# EAGLE design plen_baseboard (EAGLE 6.6.0)

## Sheet 1 of 4: Arduino Micro
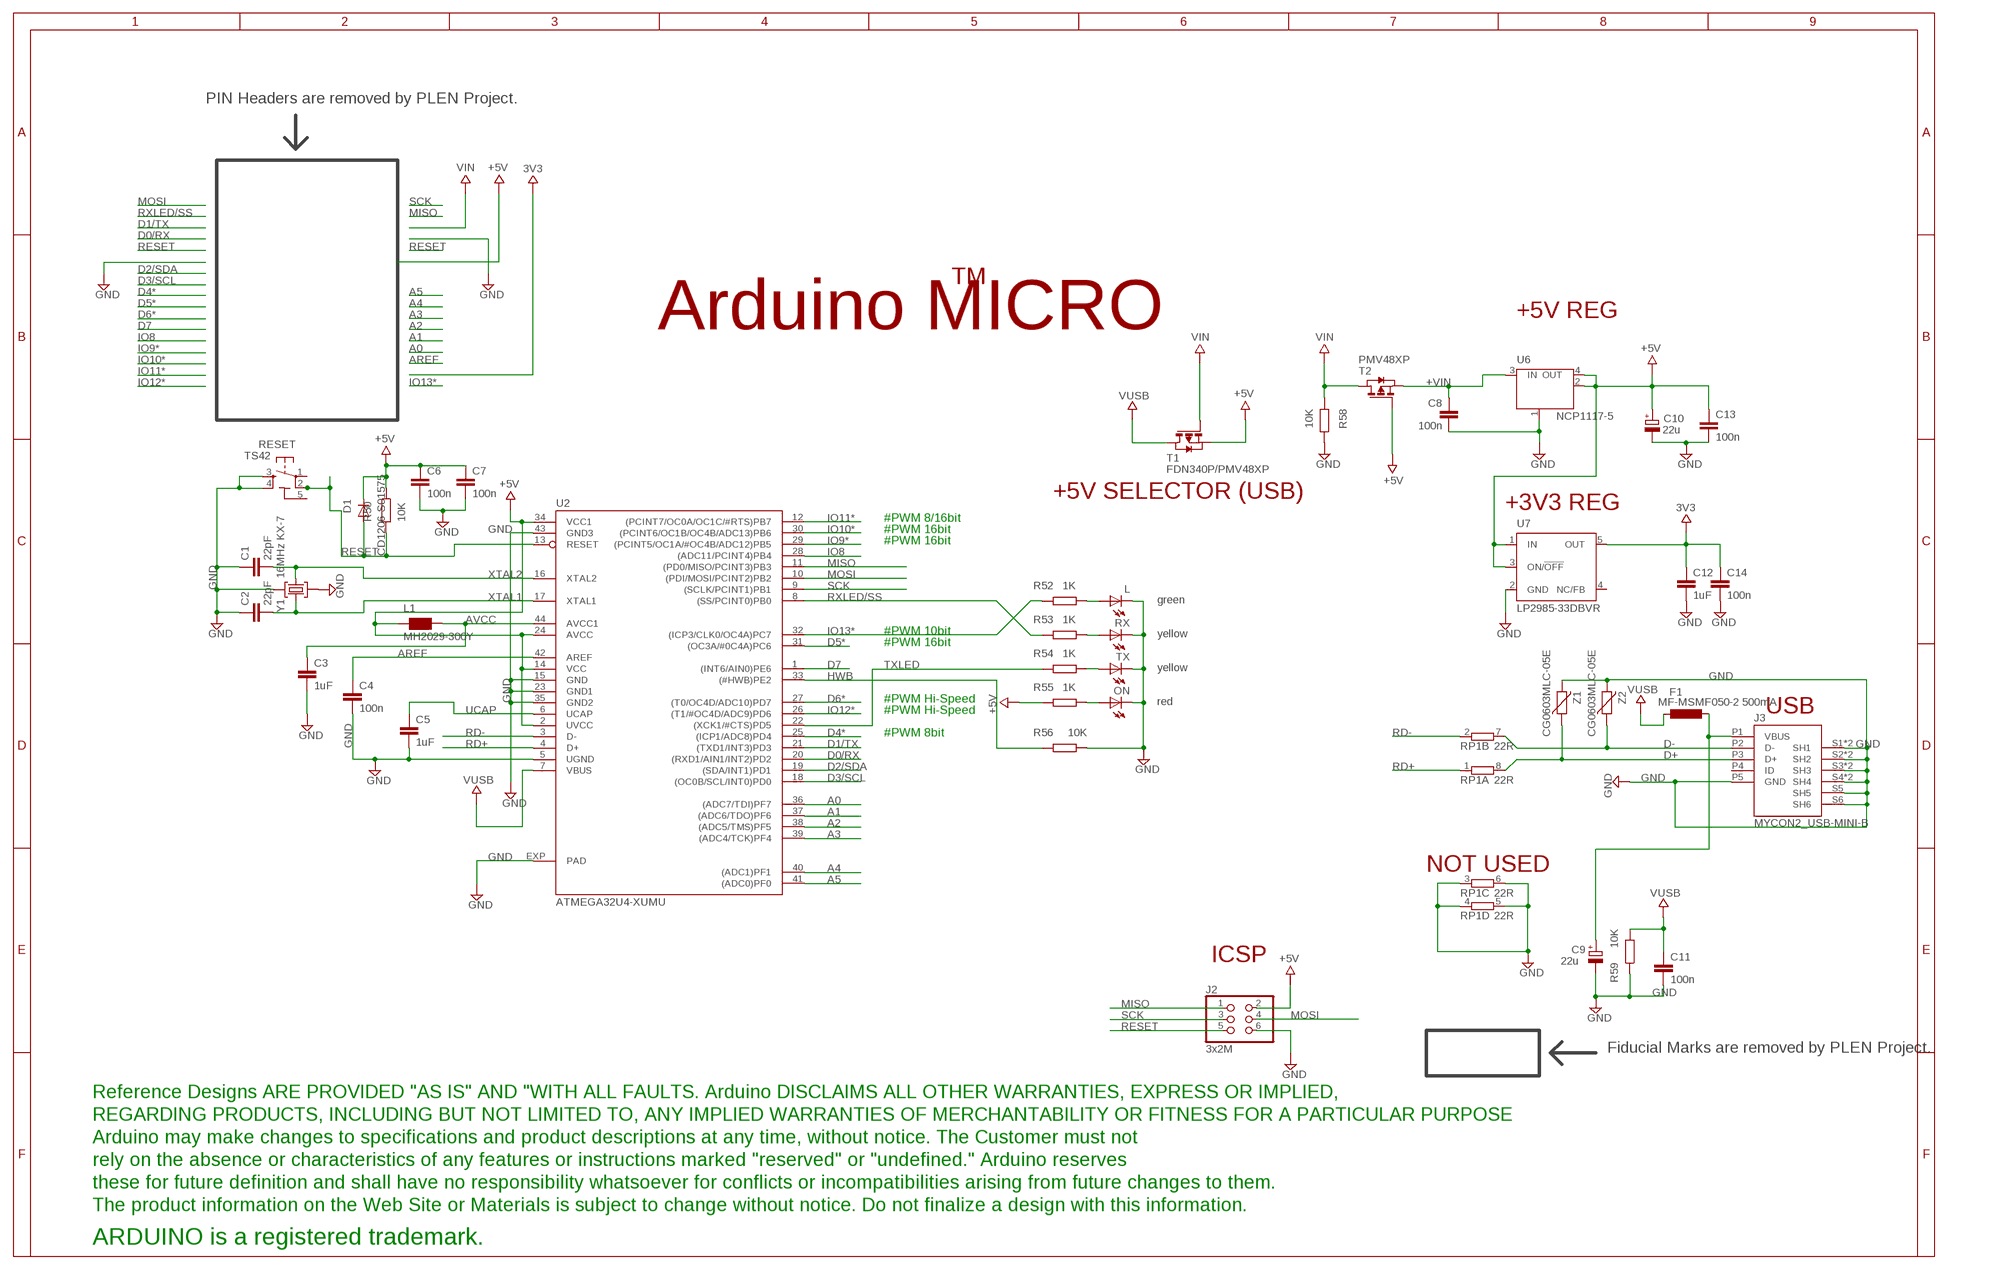
[diagram p0: schematic, sheet 1]

### Parts
C1  22pF  C-EUC0402  [C0402]
C2  22pF  C-EUC0402  [C0402]
C3  1uF  C-EUC0402  [C0402]
C4  100n  C-EUC0402  [C0402]
C5  1uF  C-EUC0402  [C0402]
C6  100n  C-EUC0402  [C0402]
C7  100n  C-EUC0402  [C0402]
C8  100n  C-EUC0402  [C0402]
C9  22u  CPOL-EUSMCB  [SMC_B]
C10  22u  CPOL-EUSMCB  [SMC_B]
C11  100n  C-EUC0402  [C0402]
C12  1uF  C-EUC0402  [C0402]
C13  100n  C-EUC0402  [C0402]
C14  100n  C-EUC0402  [C0402]
D1  CD1206-S01575  DIODE-MINIMELF  [MINIMELF]
F1  MF-MSMF050-2 500mA  L-EUL1812  [L1812]
J2  3x2M  PINHD-2X3  [2X03]
J3  MYCON2_USB-MINI-B  [CON2_USB_MICRO_B_AT]
L  green  LEDCHIPLED_0805  [CHIPLED_0805]
L1  MH2029-300Y  WE-CBF_0805  [0805]
ON  red  LEDCHIPLED_0805  [CHIPLED_0805]
R50  10K  R-EU_R0402  [R0402]
R52  1K  R-EU_R0402  [R0402]
R53  1K  R-EU_R0402  [R0402]
R54  1K  R-EU_R0402  [R0402]
R55  1K  R-EU_R0402  [R0402]
R56  10K  R-EU_R0402  [R0402]
R58  10K  R-EU_R0402  [R0402]
R59  10K  R-EU_R0402  [R0402]
RESET  TS42  [TS42]
RP1  22R  4R-NCAY16  [CAY16]
RX  yellow  LEDCHIPLED_0805  [CHIPLED_0805]
T1  FDN340P/PMV48XP  PMOSSOT23  [SOT-23]
T2  PMV48XP  PMOSSOT23  [SOT-23]
TX  yellow  LEDCHIPLED_0805  [CHIPLED_0805]
U2  ATMEGA32U4-XUMU  [QFN44ML7X7]
U6  NCP1117-5  LINEAR_MC33269ST  [LINEAR_SOT223]
U7  LP2985-33DBVR  LP2985-XXDBVR33  [SOT23-DBV]
U$3  DISCLAIMER  [DISCLAIMER]
Y1  16MHz KX-7  CRYSTAL-3.2-2.5  [CRYSTAL-3.2-2.5]
Z1  CG0603MLC-05E  VARISTORCN0603  [CT/CN0603]
Z2  CG0603MLC-05E  VARISTORCN0603  [CT/CN0603]

### Nets
3V3: C12.1 C14.1 U7.5(OUT) ; also sheet 3
+5V: C6.1 C7.1 C10.+ C13.1 D1.C J2.2 L1.1 R50.1 R55.1 T1.2(S) T2.3(G) U2.2(UVCC) U2.14(VCC) U2.24(AVCC) U2.34(VCC1) U6.2(OUT) U6.4(OUT) U7.1(IN) U7.3(ON/!OFF) ; also sheet 2,4
+VIN: C8.1 T2.2(S) U6.3(IN)
A0: U2.36((ADC7/TDI)PF7)
A1: U2.37((ADC6/TDO)PF6)
A2: U2.38((ADC5/TMS)PF5)
A3: U2.39((ADC4/TCK)PF4)
A4: U2.40((ADC1)PF1)
A5: U2.41((ADC0)PF0)
AREF: C4.1 U2.42(AREF)
AVCC: C3.1 L1.2 U2.44(AVCC1)
D0/RX: U2.20((RXD1/AIN1/INT2)PD2) ; also sheet 3
D1/TX: U2.21((TXD1/INT3)PD3) ; also sheet 3
D2/SDA: U2.19((SDA/INT1)PD1) ; also sheet 4
D3/SCL: U2.18((OC0B/SCL/INT0)PD0) ; also sheet 4
D4*: U2.25((ICP1/ADC8)PD4) ; also sheet 3
D5*: U2.31((OC3A/#0C4A)PC6) ; also sheet 2
D6*: U2.27((T0/OC4D/ADC10)PD7) ; also sheet 2
D7: U2.1((INT6/AIN0)PE6)
D+: J3.P3(D+) RP1.8 Z1.1
D-: J3.P2(D-) RP1.7 Z2.1
GND: C1.1 C2.1 C3.2 C4.2 C5.2 C6.2 C7.2 C8.2 C9.- C10.- C11.2 C12.2 C13.2 C14.2 J2.6 J3.P5(GND) J3.S1(SH1) J3.S2(SH2) J3.S3(SH3) J3.S4(SH4) J3.S5(SH5) J3.S6(SH6) J3.S7(SH1) J3.S8(SH2) J3.S9(SH3) J3.S10(SH4) L.C ON.C R56.2 R58.1 R59.1 RESET.3 RESET.4 RP1.3 RP1.4 RP1.5 RP1.6 RX.C TX.C U2.5(UGND) U2.15(GND) U2.23(GND1) U2.35(GND2) U2.43(GND3) U2.EXP(PAD) U6.1(GND/ADJ) U7.2(GND) Y1.2(GND) Y1.4(GND) Z1.2 Z2.2 ; also sheet 2,3,4
HWB: R56.1 U2.33((#HWB)PE2)
IO8: U2.28((ADC11/PCINT4)PB4)
IO9*: U2.29((PCINT5/OC1A/#OC4B/ADC12)PB5) ; also sheet 2
IO10*: U2.30((PCINT6/OC1B/OC4B/ADC13)PB6) ; also sheet 2
IO11*: U2.12((PCINT7/OC0A/OC1C/#RTS)PB7) ; also sheet 2
IO12*: U2.26((T1/#OC4D/ADC9)PD6) ; also sheet 2
IO13*: R52.1 U2.32((ICP3/CLK0/OC4A)PC7)
MISO: J2.1 U2.11((PD0/MISO/PCINT3)PB3)
MOSI: J2.4 U2.10((PDI/MOSI/PCINT2)PB2)
N$2: R53.2 RX.A
N$3: ON.A R55.2
N$4: R54.2 TX.A
N$7: L.A R52.2
RD+: RP1.1 U2.4(D+)
RD-: RP1.2 U2.3(D-)
RESET: D1.A J2.5 R50.2 RESET.2 U2.13(RESET) ; also sheet 3
RXLED/SS: R53.1 U2.8((SS/PCINT0)PB0)
SCK: J2.3 U2.9((SCLK/PCINT1)PB1)
TXLED: R54.1 U2.22((XCK1/#CTS)PD5)
UCAP: C5.1 U2.6(UCAP)
VIN: R58.2 T1.3(G) T2.1(D) ; also sheet 2
VUSB: C11.1 F1.2 R59.2 T1.1(D) U2.7(VBUS)
VUSBD: C9.+ F1.1 J3.P1(VBUS)
XTAL1: C2.2 U2.17(XTAL1) Y1.3(C2)
XTAL2: C1.2 U2.16(XTAL2) Y1.1(C1)
Unconnected: J3.P4(ID) RESET.1 U7.4(NC/FB)

### Notes on the sheet
- PIN Headers are removed by PLEN Project.
- TM
- +5V REG
- Arduino MICRO
- +5V SELECTOR (USB)
- +3V3 REG
- #PWM 8/16bit
- #PWM 16bit
- #PWM 16bit
- #PWM 10bit
- #PWM 16bit
- #PWM Hi-Speed
- #PWM Hi-Speed | USB
- #PWM 8bit
- NOT USED
- ICSP
- Fiducial Marks are removed by PLEN Project.

## Sheet 2 of 4: Multi-ServoMotor Interface
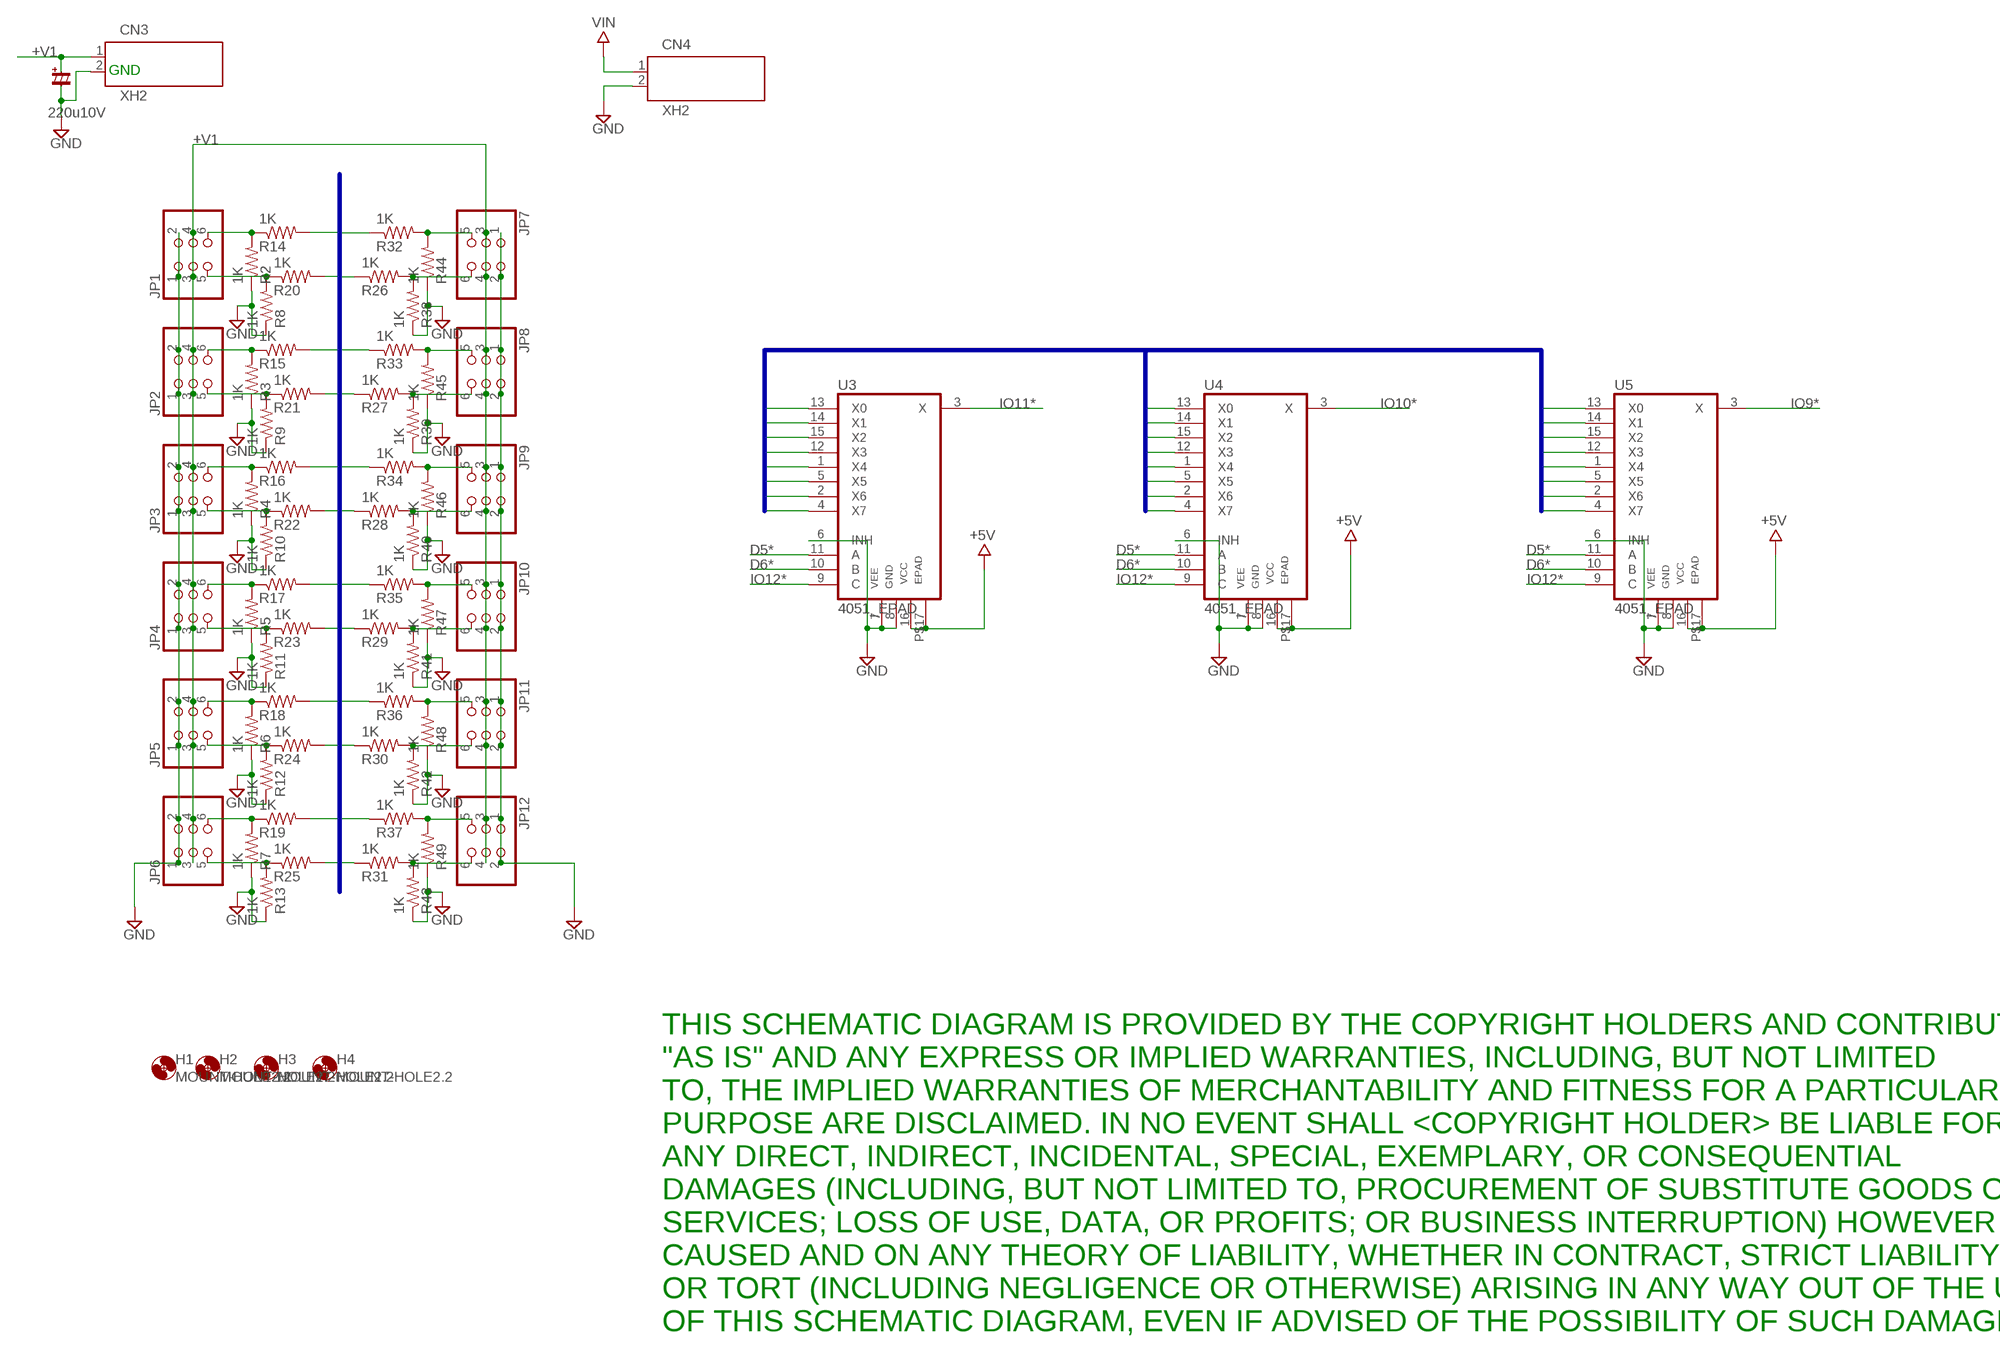
[diagram p1: schematic, sheet 2]

### Parts
CN3  XH2  [XH2]
CN4  XH2  [XH2]
CP1  220u10V  C-POL_S05-05  [CP_S05-05]
H1  MOUNT-HOLE2.2  [2,2]
H2  MOUNT-HOLE2.2  [2,2]
H3  MOUNT-HOLE2.2  [2,2]
H4  MOUNT-HOLE2.2  [2,2]
JP1  PINHD-2X03_2.54  [2X03]
JP2  PINHD-2X03_2.54  [2X03]
JP3  PINHD-2X03_2.54  [2X03]
JP4  PINHD-2X03_2.54  [2X03]
JP5  PINHD-2X03_2.54  [2X03]
JP6  PINHD-2X03_2.54  [2X03]
JP7  PINHD-2X03_2.54  [2X03]
JP8  PINHD-2X03_2.54  [2X03]
JP9  PINHD-2X03_2.54  [2X03]
JP10  PINHD-2X03_2.54  [2X03]
JP11  PINHD-2X03_2.54  [2X03]
JP12  PINHD-2X03_2.54  [2X03]
R2  1K  R-US_R0402SMALL  [R0402S]
R3  1K  R-US_R0402SMALL  [R0402S]
R4  1K  R-US_R0402SMALL  [R0402S]
R5  1K  R-US_R0402SMALL  [R0402S]
R6  1K  R-US_R0402SMALL  [R0402S]
R7  1K  R-US_R0402SMALL  [R0402S]
R8  1K  R-US_R0402SMALL  [R0402S]
R9  1K  R-US_R0402SMALL  [R0402S]
R10  1K  R-US_R0402SMALL  [R0402S]
R11  1K  R-US_R0402SMALL  [R0402S]
R12  1K  R-US_R0402SMALL  [R0402S]
R13  1K  R-US_R0402SMALL  [R0402S]
R14  1K  R-US_R0402SMALL  [R0402S]
R15  1K  R-US_R0402SMALL  [R0402S]
R16  1K  R-US_R0402SMALL  [R0402S]
R17  1K  R-US_R0402SMALL  [R0402S]
R18  1K  R-US_R0402SMALL  [R0402S]
R19  1K  R-US_R0402SMALL  [R0402S]
R20  1K  R-US_R0402SMALL  [R0402S]
R21  1K  R-US_R0402SMALL  [R0402S]
R22  1K  R-US_R0402SMALL  [R0402S]
R23  1K  R-US_R0402SMALL  [R0402S]
R24  1K  R-US_R0402SMALL  [R0402S]
R25  1K  R-US_R0402SMALL  [R0402S]
R26  1K  R-US_R0402SMALL  [R0402S]
R27  1K  R-US_R0402SMALL  [R0402S]
R28  1K  R-US_R0402SMALL  [R0402S]
R29  1K  R-US_R0402SMALL  [R0402S]
R30  1K  R-US_R0402SMALL  [R0402S]
R31  1K  R-US_R0402SMALL  [R0402S]
R32  1K  R-US_R0402SMALL  [R0402S]
R33  1K  R-US_R0402SMALL  [R0402S]
R34  1K  R-US_R0402SMALL  [R0402S]
R35  1K  R-US_R0402SMALL  [R0402S]
R36  1K  R-US_R0402SMALL  [R0402S]
R37  1K  R-US_R0402SMALL  [R0402S]
R38  1K  R-US_R0402SMALL  [R0402S]
R39  1K  R-US_R0402SMALL  [R0402S]
R40  1K  R-US_R0402SMALL  [R0402S]
R41  1K  R-US_R0402SMALL  [R0402S]
R42  1K  R-US_R0402SMALL  [R0402S]
R43  1K  R-US_R0402SMALL  [R0402S]
R44  1K  R-US_R0402SMALL  [R0402S]
R45  1K  R-US_R0402SMALL  [R0402S]
R46  1K  R-US_R0402SMALL  [R0402S]
R47  1K  R-US_R0402SMALL  [R0402S]
R48  1K  R-US_R0402SMALL  [R0402S]
R49  1K  R-US_R0402SMALL  [R0402S]
U3  4051_EPAD  [SOT763-1]
U4  4051_EPAD  [SOT763-1]
U5  4051_EPAD  [SOT763-1]

### Nets
+5V: U3.16(VCC) U3.P$17(EPAD) U4.16(VCC) U4.P$17(EPAD) U5.16(VCC) U5.P$17(EPAD) ; also sheet 1,4
+V1: CN3.1 CP1.+ JP1.3 JP1.4 JP2.3 JP2.4 JP3.3 JP3.4 JP4.3 JP4.4 JP5.3 JP5.4 JP6.3 JP6.4 JP7.3 JP7.4 JP8.3 JP8.4 JP9.3 JP9.4 JP10.3 JP10.4 JP11.3 JP11.4 JP12.3 JP12.4
D5*: U3.11(A) U4.11(A) U5.11(A) ; also sheet 1
D6*: U3.10(B) U4.10(B) U5.10(B) ; also sheet 1
GND: CN3.2 CN4.2 CP1.- JP1.1 JP1.2 JP2.1 JP2.2 JP3.1 JP3.2 JP4.1 JP4.2 JP5.1 JP5.2 JP6.1 JP6.2 JP7.1 JP7.2 JP8.1 JP8.2 JP9.1 JP9.2 JP10.1 JP10.2 JP11.1 JP11.2 JP12.1 JP12.2 R2.1 R3.1 R4.1 R5.1 R6.1 R7.1 R8.1 R9.1 R10.1 R11.1 R12.1 R13.1 R38.1 R39.1 R40.1 R41.1 R42.1 R43.1 R44.1 R45.1 R46.1 R47.1 R48.1 R49.1 U3.6(INH) U3.7(VEE) U3.8(GND) U4.6(INH) U4.7(VEE) U4.8(GND) U5.6(INH) U5.7(VEE) U5.8(GND) ; also sheet 1,3,4
IO9*: U5.3(X) ; also sheet 1
IO10*: U4.3(X) ; also sheet 1
IO11*: U3.3(X) ; also sheet 1
IO12*: U3.9(C) U4.9(C) U5.9(C) ; also sheet 1
N$1: JP1.5 R8.2 R20.1
N$5: JP1.6 R2.2 R14.1
N$6: JP3.5 R10.2 R22.1
N$8: JP2.5 R9.2 R21.1
N$9: JP2.6 R3.2 R15.1
N$10: JP3.6 R4.2 R16.1
N$11: JP4.5 R11.2 R23.1
N$12: JP4.6 R5.2 R17.1
N$13: JP5.5 R12.2 R24.1
N$14: JP5.6 R6.2 R18.1
N$15: JP6.5 R13.2 R25.1
N$16: JP6.6 R7.2 R19.1
N$17: JP7.5 R32.2 R44.2
N$18: JP7.6 R26.2 R38.2
N$19: JP9.5 R34.2 R46.2
N$20: JP8.5 R33.2 R45.2
N$21: JP8.6 R27.2 R39.2
N$22: JP9.6 R28.2 R40.2
N$23: JP10.5 R35.2 R47.2
N$24: JP10.6 R29.2 R41.2
N$25: JP11.5 R36.2 R48.2
N$26: JP11.6 R30.2 R42.2
N$27: JP12.5 R37.2 R49.2
N$28: JP12.6 R31.2 R43.2
SRV0: R14.2 U3.13(X0)
SRV1: R20.2 U3.14(X1)
SRV2: R15.2 U3.15(X2)
SRV3: R21.2 U3.12(X3)
SRV4: R16.2 U3.1(X4)
SRV5: R22.2 U3.5(X5)
SRV6: R17.2 U3.2(X6)
SRV7: R23.2 U3.4(X7)
SRV8: R18.2 U4.13(X0)
SRV9: R24.2 U4.14(X1)
SRV10: R19.2 U4.15(X2)
SRV11: R25.2 U4.12(X3)
SRV12: R32.1 U4.1(X4)
SRV13: R26.1 U4.5(X5)
SRV14: R33.1 U4.2(X6)
SRV15: R27.1 U4.4(X7)
SRV16: R34.1 U5.13(X0)
SRV17: R28.1 U5.14(X1)
SRV18: R35.1 U5.15(X2)
SRV19: R29.1 U5.12(X3)
SRV20: R36.1 U5.1(X4)
SRV21: R30.1 U5.5(X5)
SRV22: R37.1 U5.2(X6)
SRV23: R31.1 U5.4(X7)
VIN: CN4.1 ; also sheet 1

### Buses
SRV[0..23]

### Notes on the sheet
- GND
- THIS SCHEMATIC DIAGRAM IS PROVIDED BY THE COPYRIGHT HOLDERS AND CONTRIBUTORS 
  "AS IS" AND ANY EXPRESS OR IMPLIED WARRANTIES, INCLUDING, BUT NOT LIMITED 
  TO, THE IMPLIED WARRANTIES OF MERCHANTABILITY AND FITNESS FOR A PARTICULAR 
  PURPOSE ARE DISCLAIMED. IN NO EVENT SHALL <COPYRIGHT HOLDER> BE LIABLE FOR 
  ANY DIRECT, INDIRECT, INCIDENTAL, SPECIAL, EXEMPLARY, OR CONSEQUENTIAL 
  DAMAGES (INCLUDING, BUT NOT LIMITED TO, PROCUREMENT OF SUBSTITUTE GOODS OR 
  SERVICES; LOSS OF USE, DATA, OR PROFITS; OR BUSINESS INTERRUPTION) HOWEVER 
  CAUSED AND ON ANY THEORY OF LIABILITY, WHETHER IN CONTRACT, STRICT LIABILITY,
  OR TORT (INCLUDING NEGLIGENCE OR OTHERWISE) ARISING IN ANY WAY OUT OF THE USE
  OF THIS SCHEMATIC DIAGRAM, EVEN IF ADVISED OF THE POSSIBILITY OF SUCH DAMAGE.

## Sheet 3 of 4: RS485 communication port
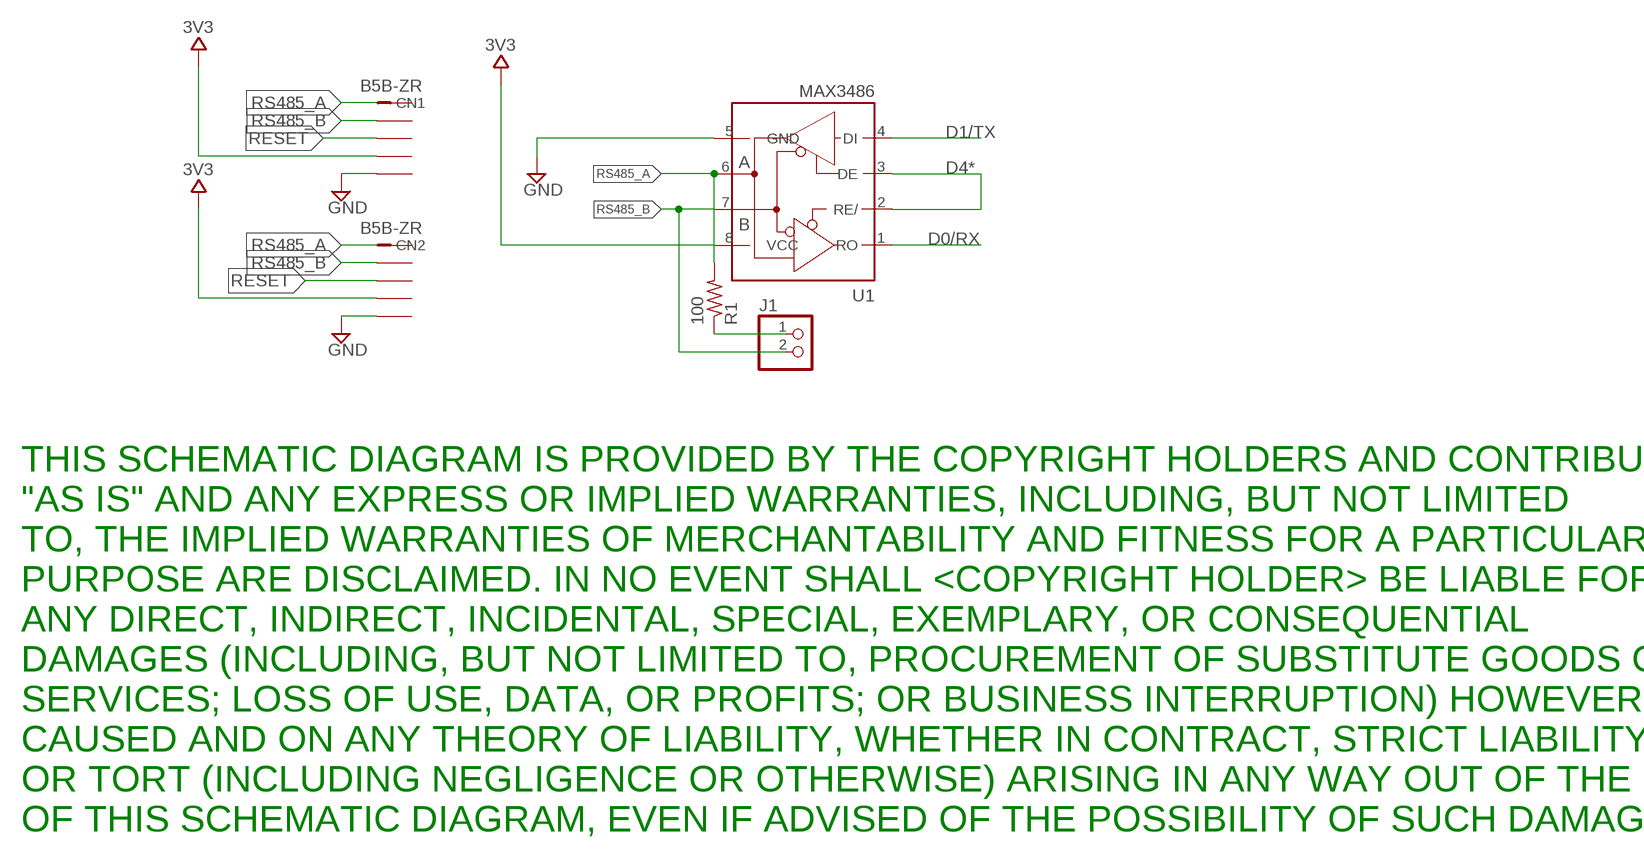
[diagram p2: schematic, sheet 3]

### Parts
CN1  B5B-ZR  [B5B-ZR]
CN2  B5B-ZR  [B5B-ZR]
J1  PINHD-1X2  [1X02]
R1  100  R-US_R0402SMALL  [R0402S]
U1  MAX3486  [SO08]

### Nets
3V3: CN1.4 CN2.4 U1.8(VCC) ; also sheet 1
D0/RX: U1.1(RO) ; also sheet 1
D1/TX: U1.4(DI) ; also sheet 1
D4*: U1.2(RE/) U1.3(DE) ; also sheet 1
GND: CN1.5 CN2.5 U1.5(GND) ; also sheet 1,2,4
N$67: J1.1 R1.1
RESET: CN1.3 CN2.3 ; also sheet 1
RS485_A: CN1.1 CN2.1 R1.2 U1.6(A)
RS485_B: CN1.2 CN2.2 J1.2 U1.7(B)

### Notes on the sheet
- THIS SCHEMATIC DIAGRAM IS PROVIDED BY THE COPYRIGHT HOLDERS AND CONTRIBUTORS 
  "AS IS" AND ANY EXPRESS OR IMPLIED WARRANTIES, INCLUDING, BUT NOT LIMITED 
  TO, THE IMPLIED WARRANTIES OF MERCHANTABILITY AND FITNESS FOR A PARTICULAR 
  PURPOSE ARE DISCLAIMED. IN NO EVENT SHALL <COPYRIGHT HOLDER> BE LIABLE FOR 
  ANY DIRECT, INDIRECT, INCIDENTAL, SPECIAL, EXEMPLARY, OR CONSEQUENTIAL 
  DAMAGES (INCLUDING, BUT NOT LIMITED TO, PROCUREMENT OF SUBSTITUTE GOODS OR 
  SERVICES; LOSS OF USE, DATA, OR PROFITS; OR BUSINESS INTERRUPTION) HOWEVER 
  CAUSED AND ON ANY THEORY OF LIABILITY, WHETHER IN CONTRACT, STRICT LIABILITY,
  OR TORT (INCLUDING NEGLIGENCE OR OTHERWISE) ARISING IN ANY WAY OUT OF THE USE
  OF THIS SCHEMATIC DIAGRAM, EVEN IF ADVISED OF THE POSSIBILITY OF SUCH DAMAGE.

## Sheet 4 of 4: EEPROM
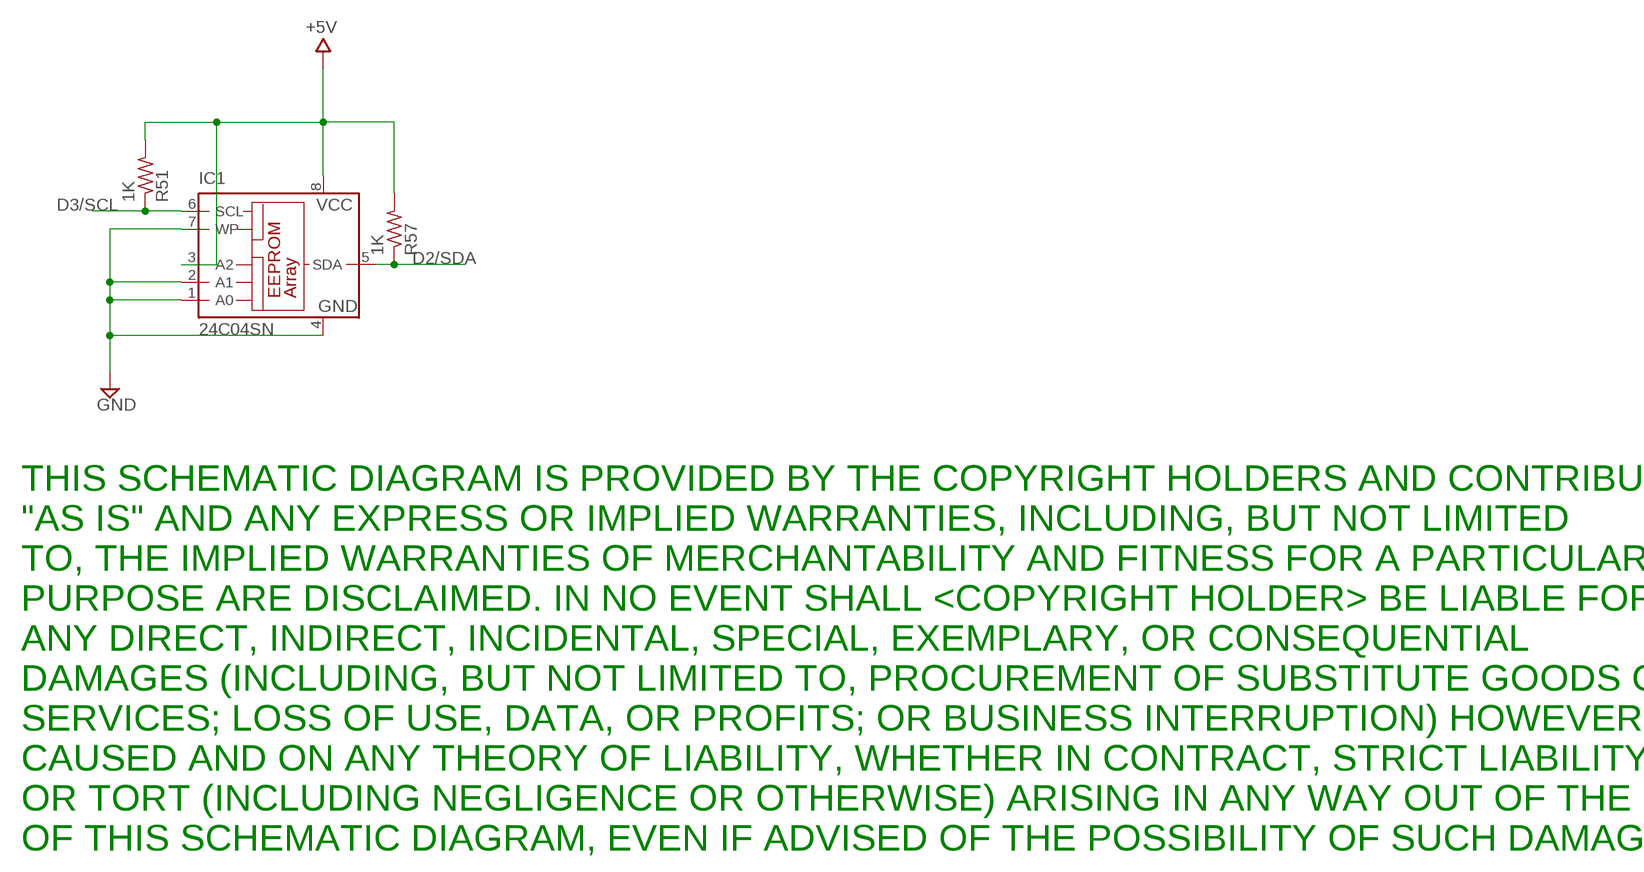
[diagram p3: schematic, sheet 4]

### Parts
IC1  24C04SN  [SO-08]
R51  1K  R-US_R0402SMALL  [R0402S]
R57  1K  R-US_R0402SMALL  [R0402S]

### Nets
+5V: IC1.3(A2) IC1.8(VCC) R51.2 R57.2 ; also sheet 1,2
D2/SDA: IC1.5(SDA) R57.1 ; also sheet 1
D3/SCL: IC1.6(SCL) R51.1 ; also sheet 1
GND: IC1.1(A0) IC1.2(A1) IC1.4(GND) IC1.7(WP) ; also sheet 1,2,3

### Notes on the sheet
- THIS SCHEMATIC DIAGRAM IS PROVIDED BY THE COPYRIGHT HOLDERS AND CONTRIBUTORS 
  "AS IS" AND ANY EXPRESS OR IMPLIED WARRANTIES, INCLUDING, BUT NOT LIMITED 
  TO, THE IMPLIED WARRANTIES OF MERCHANTABILITY AND FITNESS FOR A PARTICULAR 
  PURPOSE ARE DISCLAIMED. IN NO EVENT SHALL <COPYRIGHT HOLDER> BE LIABLE FOR 
  ANY DIRECT, INDIRECT, INCIDENTAL, SPECIAL, EXEMPLARY, OR CONSEQUENTIAL 
  DAMAGES (INCLUDING, BUT NOT LIMITED TO, PROCUREMENT OF SUBSTITUTE GOODS OR 
  SERVICES; LOSS OF USE, DATA, OR PROFITS; OR BUSINESS INTERRUPTION) HOWEVER 
  CAUSED AND ON ANY THEORY OF LIABILITY, WHETHER IN CONTRACT, STRICT LIABILITY,
  OR TORT (INCLUDING NEGLIGENCE OR OTHERWISE) ARISING IN ANY WAY OUT OF THE USE
  OF THIS SCHEMATIC DIAGRAM, EVEN IF ADVISED OF THE POSSIBILITY OF SUCH DAMAGE.

## Power pins joined to a net without a drawn wire
5-GND: RESET.5(5-GND)

## Library data of the parts
C1-C8 C11-C14 = SmartPrj:C-EU: CAPACITOR, European symbol
C9 C10 = rcl:CPOL-EU: POLARIZED CAPACITOR, European symbol
CN1 CN2 = my_jstcon:B5B-ZR
CN3 CN4 = my-misc:XH2
CP1 = my-misc:C-POL
D1 = diode:DIODE-: DIODE
F1 = rcl:L-EU: INDUCTOR, European symbol
H1-H4 = holes:MOUNT-HOLE: MOUNTING HOLE with drill center marker
IC1 = microchip:24C*: Serial EEPROM 1 K/2 K/4 K; MPN: M24C04-WMN6P; OC_FARNELL: 9882812; OC_NEWARK: 83K1376
J1 = pinhead:PINHD-1X2: PIN HEADER
J2 = SmartPrj:PINHD-2X3: PIN HEADER
J3 = SmartPrj:MYCON2_USB-MINI-B
JP1-JP12 = pinhead-2:PINHD-2X03: PIN HEADER
L ON RX TX = led:LED: LED OSRAM: - CHIPLED LG R971, LG N971, LY N971, LG Q971, LY Q971, LO R971, LY R971 LH N974, LH R974 LS Q976, LO Q976, LY Q976 LO Q996 - Hyper CHIPLED LW Q18S LB Q993, LB Q99A, LB R99A - SideLED LS A670, LO A670, LY A670, LG A670, LP A670 LB A673, LV A673, LT A673, LW A673 LH A674 LY A675 LS A676, LA A676, LO A676, LY A676, LW A676 LS A679, LY A679, LG A679 - Hyper Micro SIDELED® LS Y876, LA Y876, LO Y876, LY Y876 LT Y87S - SmartLED LW L88C, LW L88S LB L89C, LB L89S, LG L890 LS L89K, LO L89K, LY L89K LS L896, LA L896, LO L896, LY L896 - TOPLED LS T670, LO T670, LY T670, LG T670, LP T670 LSG T670, LSP T670, LSY T670, LOP T670, LYG T670 LG T671, LOG T671, LSG T671 LB T673, LV T673, LT T673, LW T673 LH T674 LS T676, LA T676, LO T676, LY T676, LB T676, LH T676, LSB T676, LW T676 LB T67C, LV T67C, LT T67C, LS T67K, LO T67K, LY T67K, LW E67C LS E67B, LA E67B, LO E67B, LY E67B, LB E67C, LV E67C, LT E67C LW T67C LS T679, LY T679, LG T679 LS T770, LO T770, LY T770, LG T770, LP T770 LB T773, LV T773, LT T773, LW T773 LH T774 LS E675, LA E675, LY E675, LS T675 LS T776, LA T776, LO T776, LY T776, LB T776 LHGB T686 LT T68C, LB T68C - Hyper Mini TOPLED® LB M676 - Mini TOPLED Santana® LG M470 LS M47K, LO M47K, LY M47K Source: http://www.osram.convergy.de LUXEON: - LUMILED® LXK2-PW12-R00, LXK2-PW12-S00, LXK2-PW14-U00, LXK2-PW14-V00 LXK2-PM12-R00, LXK2-PM12-S00, LXK2-PM14-U00 LXK2-PE12-Q00, LXK2-PE12-R00, LXK2-PE12-S00, LXK2-PE14-T00, LXK2-PE14-U00 LXK2-PB12-K00, LXK2-PB12-L00, LXK2-PB12-M00, LXK2-PB14-N00, LXK2-PB14-P00, LXK2-PB14-Q00 LXK2-PR12-L00, LXK2-PR12-M00, LXK2-PR14-Q00, LXK2-PR14-R00 LXK2-PD12-Q00, LXK2-PD12-R00, LXK2-PD12-S00 LXK2-PH12-R00, LXK2-PH12-S00 LXK2-PL12-P00, LXK2-PL12-Q00, LXK2-PL12-R00 Source: www.luxeon.com KINGBRIGHT: KA-3528ASYC Source: www.kingbright.com
L1 = wuerth-elektronik:WE-CBF: SMD EMI Suppression Ferrite Beads - excellent anti-EMI properties - low DCR - impedances till 3000 ohms - rated current up to 6 A
R1-R49 R51 R57 = rcl:R-US_: RESISTOR, American symbol
R50 R52-R56 R58 R59 = SmartPrj:R-EU_: RESISTOR, European symbol
RESET = SmartPrj:TS42: TS42 Dongnan Electronics Tact switch VDC 12V - 50mA
RP1 = resistor-dil:4R-N: Array Chip Resistor Source: RS Component / Phycomp
T1 T2 = zetex:PMOSSOT23: MOS FET
U1 = maxim:MAX3486
U2 = SmartPrj:ATMEGA32U4-XU
U3-U5 = 40xx:4051_EPAD
U6 = SmartPrj:LINEAR_MC33269ST*: Adjustable Output Low Dropout Voltage Regulator 800 mA Source: http://www.onsemi.com/pub/Collateral/MC33269-D.PDF
U7 = SmartPrj:LP2985-XXDBVR: ULTRALOW-POWER 50-mA LOW-DROPOUT LINEAR REGULATORS 50-mA Low-Dropout Regulator Source: http://focus.ti.com/lit/ds/symlink/tps77001.pdf
U$3 = SmartPrj:DISCLAIMER
Y1 = SmartPrj:CRYSTAL-3.2-2.5
Z1 Z2 = varistor:VARISTOR: VARISTOR

## Board
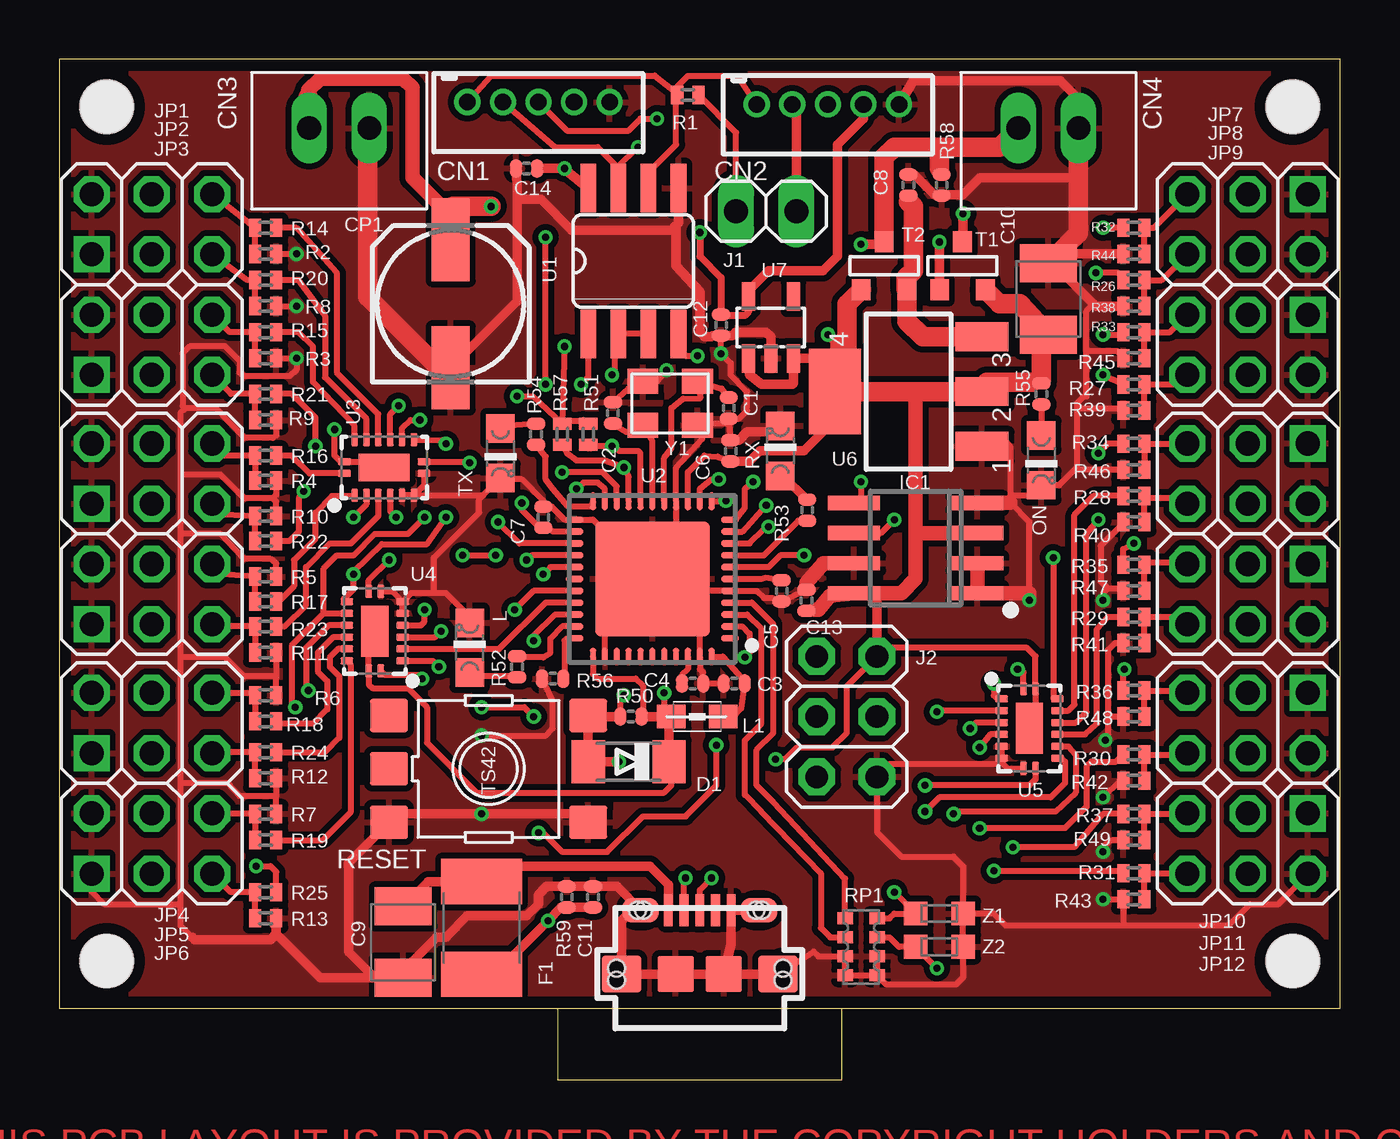
[diagram p4: board, top side]
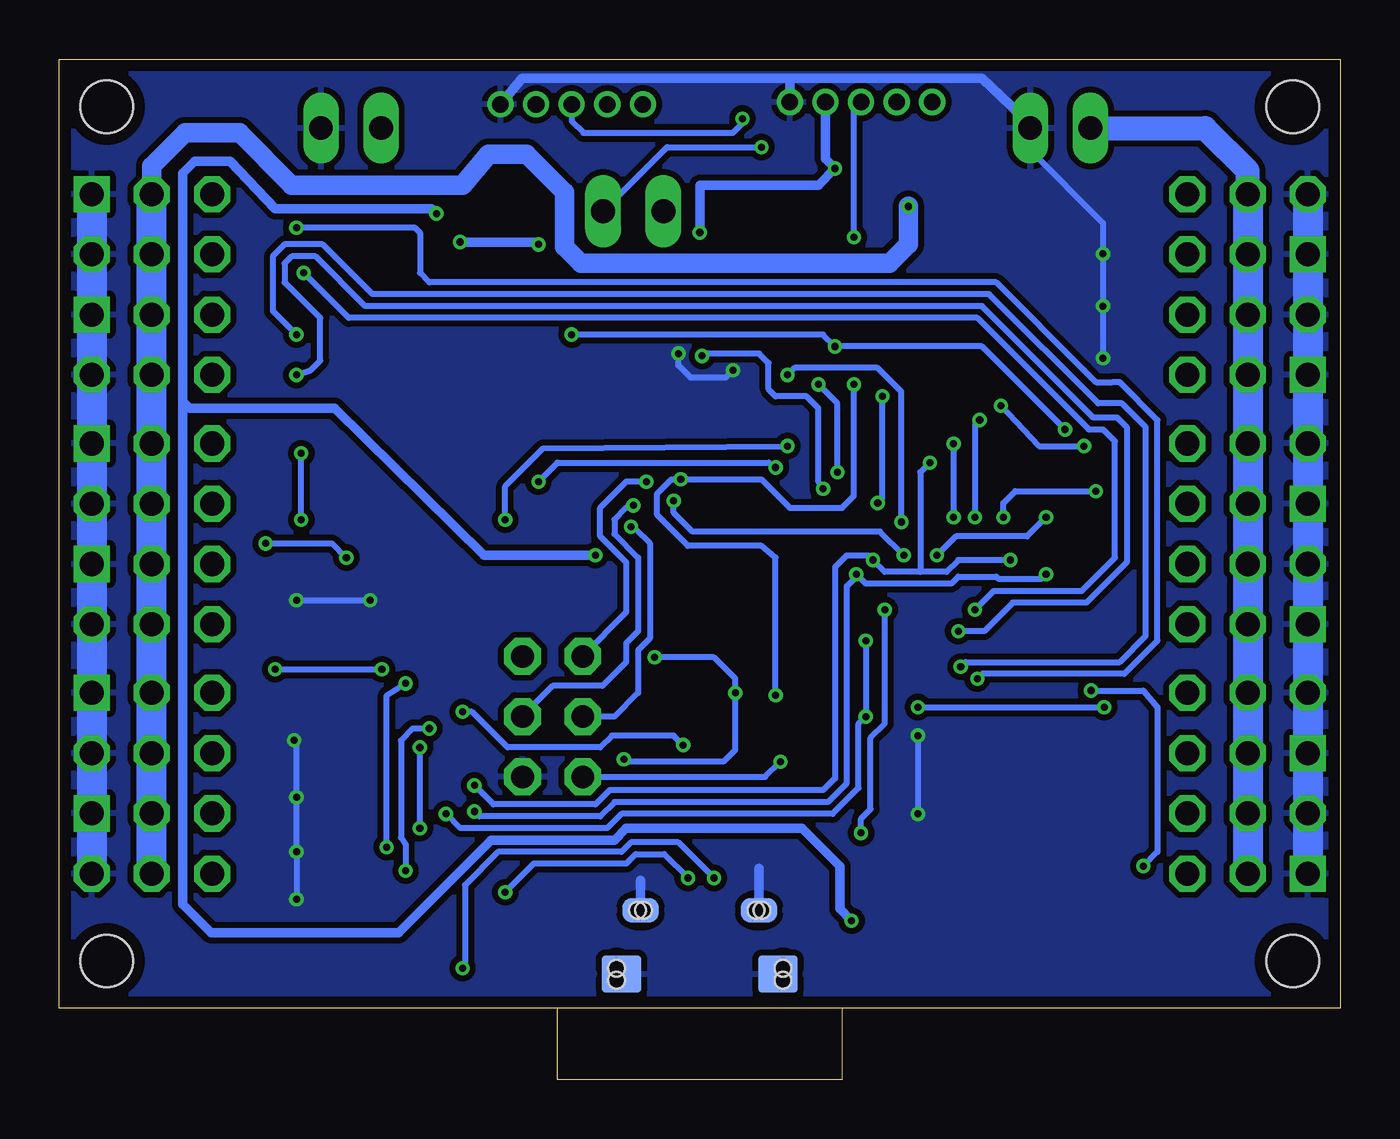
[diagram p5: board, bottom side, seen from below]

Size 54 x 43 mm. Coordinates in mm from the lower left corner, seen from the top.
Outline: 21,3 0,3 0,43 54,43 54,3 33,3
Outline: 21,3 33,3
Outline: 21,3 21,0 33,0 33,3
Copper layers (1*16): Top 0.035mm / dielectric 1.53mm / Bottom 0.035mm
Design rules "pban_5mil-l2": minimum track width 5mil, minimum drill 0.3mm, track to track 5mil, track to pad 0.229mm, pad to pad 5mil, via to via 5mil, smd to smd 5mil, copper to edge 0.5mm, drill to drill 0.5mm, minimum pad ring 0.15mm, minimum via ring 0.15mm, stop-mask expansion 4mil, vias tented up to drill 0.35mm, thermal gap 10mil

### Footprints (pad centres in the part's own frame; a part is rotated, then mirrored left to right if it is on the bottom)
C0402 = smd 0.508 x 0.762: 1 -0.445,0; 2 0.445,0
SMC_B = smd 1.6 x 2.4: + -1.5,0; - 1.5,0
B5B-ZR = drill 0.7 pad 1.1: 1 -3,0; 2 -1.5,0; 3 0,0; 4 1.5,0; 5 3,0
XH2 = drill 1 long: 1 0,1.27; 2 0,-1.27
CP_S05-05 = smd 3.5 x 1.6: + 2.7,0; - -2.7,0
MINIMELF = smd 1.4 x 1.8: A 1.7,0; C -1.7,0
L1812 = smd 1.9 x 3.4: 1 -1.95,0; 2 1.95,0
2,2 = hole 2.2: 0,0
SO-08 = smd 0.6 x 2.2: 1 -1.905,-2.6; 2 -0.635,-2.6; 3 0.635,-2.6; 4 1.905,-2.6; 5 1.905,2.6; 6 0.635,2.6; 7 -0.635,2.6; 8 -1.905,2.6
1X02 = drill 1.016 long: 1 -1.27,0; 2 1.27,0
2X03 = drill 0.95 pad 1.55 octagon: 1 -2.54,-1.27; 2 -2.54,1.27; 3 0,-1.27; 4 0,1.27; 5 2.54,-1.27; 6 2.54,1.27
CON2_USB_MICRO_B_AT = smd 0.406 x 1.346: P1 -1.321,2.692; P2 -0.66,2.692; P3 0,2.692; P4 0.66,2.692; P5 1.321,2.692 | smd 1.651 x 1.549: S1 -3.302,0; S2 3.302,0 | smd 1.524 x 1.016: S3 -2.489,2.692; S4 2.489,2.692 | smd 1.524 x 1.524: S5 -1.016,0; S6 1.016,0 | smd 1.651 x 1.549 bottom: S7 -3.302,0; S8 3.302,0 | smd 1.524 x 1.016 bottom: S9 2.489,2.692; S10 -2.489,2.692 | hole 0.7: -3.505,0.254; -3.505,-0.254; 3.505,0.254; 3.505,-0.254; -2.616,2.692; -2.362,2.692; 2.362,2.692; 2.616,2.692
2X03' = drill 1.016 square: 1 -2.54,-1.27 | drill 1.016 octagon: 2 -2.54,1.27; 3 0,-1.27; 4 0,1.27; 5 2.54,-1.27; 6 2.54,1.27
CHIPLED_0805 = smd 1.2 x 1.2: A 0,-1.05; C 0,1.05
0805 = smd 1.2 x 1: 1 -1.1,0; 2 1.1,0
R0402S = smd 0.51 x 0.77: 1 -0.45,0; 2 0.45,0
R0402 = smd 0.508 x 0.762: 1 -0.445,0; 2 0.445,0
TS42 = smd 1.6 x 1.4: 1 -4.2,2.25; 2 4.2,2.25; 3 -4.2,-2.25; 4 4.2,-2.25; 5 -4.2,0
CAY16 = smd 0.5 x 0.65: 1 -1.2,-0.675; 2 -0.4,-0.675; 3 0.4,-0.675; 4 1.2,-0.675; 5 1.2,0.675; 6 0.4,0.675; 7 -0.4,0.675; 8 -1.2,0.675
SOT-23 = smd 0.787 x 0.889: 1 0.025,-1.016; 2 -0.94,1.016; 3 0.991,1.016
SO08 = smd 0.66 x 2.032: 1 -1.905,-3.073; 2 -0.635,-3.073; 3 0.635,-3.073; 4 1.905,-3.073; 5 1.905,3.073; 6 0.635,3.073; 7 -0.635,3.073; 8 -1.905,3.073
QFN44ML7X7 = smd 0.75 x 0.275: 1 -3.275,2.5; 2 -3.275,2; 3 -3.275,1.5; 4 -3.275,1; 5 -3.275,0.5; 6 -3.275,0; 7 -3.275,-0.5; 8 -3.275,-1; 9 -3.275,-1.5; 10 -3.275,-2; 11 -3.275,-2.5; 23 3.275,-2.5; 24 3.275,-2; 25 3.275,-1.5; 26 3.275,-1; 27 3.275,-0.5; 28 3.275,0; 29 3.275,0.5; 30 3.275,1; 31 3.275,1.5; 32 3.275,2; 33 3.275,2.5 | smd 0.275 x 0.75: 12 -2.5,-3.275; 13 -2,-3.275; 14 -1.5,-3.275; 15 -1,-3.275; 16 -0.5,-3.275; 17 0,-3.275; 18 0.5,-3.275; 19 1,-3.275; 20 1.5,-3.275; 21 2,-3.275; 22 2.5,-3.275; 34 2.5,3.275; 35 2,3.275; 36 1.5,3.275; 37 1,3.275; 38 0.5,3.275; 39 0,3.275; 40 -0.5,3.275; 41 -1,3.275; 42 -1.5,3.275; 43 -2,3.275; 44 -2.5,3.275 | smd 4.826 x 4.826: EXP 0,0
SOT763-1 = smd 0.55 x 0.3: 1 -1.675,-0.25; 8 1.675,-0.25; 9 1.675,0.25; 16 -1.675,0.25 | smd 0.3 x 0.55: 2 -1.25,-1.175; 3 -0.75,-1.175; 4 -0.25,-1.175; 5 0.25,-1.175; 6 0.75,-1.175; 7 1.25,-1.175; 10 1.25,1.175; 11 0.75,1.175; 12 0.25,1.175; 13 -0.25,1.175; 14 -0.75,1.175; 15 -1.25,1.175 | smd 2.15 x 1.15: P$17 0,0
LINEAR_SOT223 = smd 1.219 x 2.235: 1 -2.311,-3.099; 2 0,-3.099; 3 2.311,-3.099 | smd 3.6 x 2.2: 4 0,3.099
SOT23-DBV = smd 0.55 x 1.2: 1 -0.95,-1.3; 2 0,-1.3; 3 0.95,-1.3; 4 0.95,1.3; 5 -0.95,1.3
CRYSTAL-3.2-2.5 = smd 1.3 x 1.05: 1 -1.15,-0.925; 2 1.15,-0.925; 3 1.15,0.925; 4 -1.15,0.925
CT/CN0603 = smd 1 x 1: 1 -1,0; 2 1,0

### Placement (x,y rotation side)
C1  28.22,28.3 90 top
C2  23.34,28.1 270 top
C3  28.45,16.7 180 top
C4  26.7,16.7 0 top
C5  30.45,20.6 270 top
C6  28.3,26.5 90 top
C7  20.4,23.7 90 top
C8  35.8,37.7 90 top
C9  14.5,5.8 270 top
C10  41.7,32.9 90 top
C11  22.5,7.7 90 top
C12  27.9,31.8 270 top
C13  31.5,20.2 90 top
C14  19.7,38.4 180 top
CN1  20.2,41.2 0 top
CN2  32.4,41.1 0 top
CN3  11.8,40.1 90 top
CN4  41.7,40.1 90 top
CP1  16.5,32.7 90 top
D1  24,13.4 180 top
F1  17.8,6.4 270 top
H1  2,5 0 top
H2  52,5 0 top
H3  52,41 0 top
H4  2,41 0 top
IC1  36.1,22.4 90 top
J1  29.8,36.6 0 top
J2  33.2,15.3 270 top
J3  27,4.45 0 top
JP1  [2X03']  3.9,36.05 0 top
JP2  [2X03']  3.9,30.97 0 top
JP3  [2X03']  3.9,25.54 0 top
JP4  [2X03']  3.9,20.46 0 top
JP5  [2X03']  3.9,15.03 0 top
JP6  [2X03']  3.9,9.95 0 top
JP7  [2X03']  50.1,36.05 180 top
JP8  [2X03']  50.1,30.97 180 top
JP9  [2X03']  50.1,25.54 180 top
JP10  [2X03']  50.1,20.46 180 top
JP11  [2X03']  50.1,15.03 180 top
JP12  [2X03']  50.1,9.95 180 top
L  17.3,18.2 0 top
L1  26.9,15.3 0 top
ON  41.4,26.1 180 top
R1  26.5,41.5 180 top
R2  8.7,34.8 180 top
R3  8.7,30.4 180 top
R4  8.7,25.25 180 top
R5  8.7,21.2 180 top
R6  8.7,16.2 180 top
R7  8.7,11.2 180 top
R8  8.7,32.6 180 top
R9  8.7,27.8 180 top
R10  8.7,23.75 180 top
R11  8.7,18 180 top
R12  8.7,12.7 180 top
R13  8.7,6.8 180 top
R14  8.7,35.9 0 top
R15  8.7,31.5 0 top
R16  8.7,26.3 0 top
R17  8.7,20.15 0 top
R18  8.7,15.1 0 top
R19  8.7,10.1 0 top
R20  8.7,33.7 0 top
R21  8.7,28.9 0 top
R22  8.7,22.7 0 top
R23  8.7,19.1 0 top
R24  8.7,13.8 0 top
R25  8.7,7.9 0 top
R26  45.3,33.7 0 top
R27  45.3,29.3 0 top
R28  45.3,24.6 0 top
R29  45.3,19.5 0 top
R30  45.3,13.7 0 top
R31  45.3,8.7 0 top
R32  45.3,35.9 0 top
R33  45.3,31.5 0 top
R34  45.3,26.8 0 top
R35  45.3,21.7 0 top
R36  45.3,16.4 0 top
R37  45.3,11.2 0 top
R38  45.3,32.6 0 top
R39  45.3,28.2 0 top
R40  45.3,23.5 0 top
R41  45.3,18.4 0 top
R42  45.3,12.6 0 top
R43  45.3,7.6 0 top
R44  45.3,34.8 0 top
R45  45.3,30.4 0 top
R46  45.3,25.7 0 top
R47  45.3,20.6 0 top
R48  45.3,15.3 0 top
R49  45.3,10.1 0 top
R50  24.1,15.3 180 top
R51  22.3,27.2 90 top
R52  19.3,17.4 270 top
R53  31.53,24 90 top
R54  20.1,27.2 90 top
R55  41.4,28.9 270 top
R56  20.8,16.9 180 top
R57  21.2,27.2 90 top
R58  37.2,37.7 90 top
R59  21.4,7.7 270 top
RESET  18.1,13.1 0 top
RP1  33.8,5.6 270 top
RX  30.4,26.5 0 top
T1  38.1,34.3 180 top
T2  34.8,34.3 180 top
TX  18.6,26.4 180 top
U1  24.2,34.5 0 top
U2  25,21.1 180 top
U3  13.7,25.8 0 top
U4  13.3,18.9 90 top
U5  40.9,14.8 270 top
U6  35.8,29 90 top
U7  30,31.7 0 top
U$3  0,-7 0 top  (outside the outline)
Y1  25.75,28.5 180 top
Z1  37.1,7 0 top
Z2  37.1,5.6 0 top

### Tracks (layer width: path | path; a pad name or v marks a point on that pad's centre or on a via)
3V3  (via drill 0.3)
  Top 0.254: 22.3,36.77 U1.8 | C12.1 27.9,32.4
  Top 0.305: U7.5 29.05,32.35 28.9,32.2 28.24,32.2 C12.1 | v27,35.7 27,34.7 27.9,33.8 27.9,32.4
  Top 0.406: CN2.4 33.9,40.5 32.8,39.4 32.8,34.7 32.2,34.1 29.9,34.1 29.05,33.25 U7.5 | C14.1 v21.3,38.4 21.3,38.37 U1.8
  Bottom 0.406: v27,35.7 27,37.7 22,37.7 v21.3,38.4 21.7,38.8 CN1.4
+5V  (via drill 0.3)
  Top 0.254: U5.P$17 41.15,15.05 U5.16 41.15,17.85 40.8,18.2 34.83,18.2 J2.2 33.2,16.57 33.2,14.6 32.6,14 31.1,14 30.6,13.5 v30.2,13.5 | U2.14 26.5,25.6 27.2,26.3 27.76,26.26 C6.1 | U2.24 20.8,23.1 20.55,23.34 20.55,23.36 C7.1 20.24,23.26 19.5,24 v19.5,24.3 | U2.34 22.5,17.1 22.7,16.9 24.3,16.9 24.6,16.6 24.6,15.36 R50.1 | U2.2 28.8,19.1 29.1,18.8 29.1,18 v28.9,17.8 | v25.5,16.3 25.5,15.6 L1.1 | 22.16,27.74 21.45,27.74 21.5,27.7 R57.2 | 34.4,20.5 IC1.8 33.8,20.5 33.7,20.5 | 32.4,30 32.8,30 33.1,30.3 32.9,30.5 U6.4 | U3.P$17 13.45,26.05 U3.16 11.85,26.05 11.6,26.3 v11.6,27.4 | U4.P$17 | R51.2 22.16,27.74 | 22.16,27.74 22.1,27.8 | D1.C 25.8,13.3 25.8,12.4 25.5,12.1 17.6,12.1 15.5,14.2 15.5,15.7 14.7,16.5 13.2,16.5 13.05,16.65 U4.16 13.05,18.65 U4.P$17 | 13.55,18.55 U4.P$17 | v19.3,28.8 19.95,28.8 R57.2 | v21.3,30.9 R57.2
  Top 0.305: 34.4,17.91 J2.2 | 34.4,20.51 34.4,20.5
  Top 0.406: U6.4 33.1,30.4 U7.3 30.95,29.35 30.9,29.3 29.6,29.3 29.1,29.7 29.1,30.35 U7.1 | R50.1 L1.1 25.7,15.2 D1.C | U6.2 38.7,29 | 33.8,20.5 34.4,20.5 34.47,20.43 J2.2 | U6.4 33,28.1 31.4,26.5 29.54,26.5 29.1,26.05 C6.1 | U6.4 32.7,29.3 32.7,31.1 v32.4,31.4 | 31.84,19.8 31.95,19.81 C13.1 | 41.4,29.5 R55.1 41.34,29.4 41,29.4
  Top 0.61: 34.4,20.5 35.5,20.5 36.1,21.1 36.1,23.04 | 36.1,23.04 36.1,28.8 35.9,29 | IC1.8 32.49,20.39 32,19.8 31.84,19.8 | IC1.3 36.1,23.04
  Top 0.813: T1.2 39.62,32.7 40.5,32.7 C10.+ 41.4,31.1 41.4,29.5 | 33.2,29 35.9,29 38.7,29 39.1,29.4 41,29.4 | 33.2,29 U6.4 | T2.3 33.2,32.67 33.2,29
  Bottom 0.254: v28.9,17.8 26.4,17.8 25.5,16.9 v25.5,16.3 25.5,13.9 26,13.4 30.1,13.4 v30.2,13.5 | v19.5,24.3 19.3,24.5 v19.3,28.8 | v11.6,27.4 15.1,30.9 v21.3,30.9 21.8,31.4 v32.4,31.4
+V1  (via drill 0.3)
  Top 0.406: 16.6,36.8 16.5,36.7
  Top 0.61: 10.5,41.4 10.5,41.7 11,42.19 14.5,42.19 14.9,41.8 14.9,38 16.5,36.4
  Top 0.813: CP1.+ 16.5,36.4 16.5,36.7 | 10.5,41.4 10.5,40.13 CN3.1 | v18.2,36.8 16.6,36.8
  Bottom 0.813: 50.2,37.42 JP7.3 50.1,38.5 48.7,39.9 46.4,39.9 44.2,37.7 37,37.7 35.9,39 34.3,39 32.7,37.4 32.7,35.1 32,34.4 19,34.4 18.2,35.2 v18.2,36.8
  Bottom 1.016: JP1.4 3.9,38.3 5.7,40.1 CN3.1
  Bottom 1.27: JP12.4 JP12.3 JP11.4 JP11.3 JP10.4 JP10.3 JP9.4 JP9.3 JP8.4 JP8.3 JP7.4 JP7.3 | JP1.4 JP1.3 JP2.4 JP2.3 JP3.4 JP3.3 JP4.4 JP4.3 JP5.4 JP5.3 JP6.4 JP6.3
+VIN
  Top 0.406: C8.1 35.74,37.2 35.8,37.13 35.8,37
  Top 0.813: U6.3 39.19,31.3 36.4,31.3 35.74,31.96 T2.2 35.7,33.32 35.7,33.8 36,34.1 36,36.8 35.8,37
AREF
  Top 0.254: U2.42 26.5,17.3 26.26,17.06 C4.1
AVCC
  Top 0.254: U2.44 27.98,17.82 28.74,16.96 C3.1 28.74,15.64 28.4,15.3 L1.2
D0/RX  (via drill 0.3)
  Top 0.254: U2.20 23.5,25 22.9,25.6 v21.2,25.6 | 22.09,29.39 v22,29.3 22.3,29.59 U1.1
  Bottom 0.254: v21.2,25.6 21.2,28.5 v22,29.3
D1/TX  (via drill 0.3)
  Top 0.254: U2.21 23,24.9 22.7,25.16 22.1,25.16 v21.8,24.9 | U1.4 26.11,30.89 26.4,30.5 v26.9,30.5
  Bottom 0.254: v21.8,24.9 22,25.2 22,28.3 22.5,28.8 23.8,28.8 24.1,29.1 24.1,30.2 24.5,30.6 26.8,30.6 v26.9,30.5
D2/SDA  (via drill 0.3)
  Top 0.254: U2.19 24,25.4 v23.8,25.8 23,26.1 21.8,26.1 21.4,26.4 R57.1 | v33.8,25.2 33.8,24.4 33.7,24.3 IC1.5
  Bottom 0.254: v33.8,25.2 33,26 24.1,26 v23.8,25.8
D3/SCL  (via drill 0.3)
  Top 0.254: 22.3,26.6 R51.1 | U2.18 24.5,26.4 24.4,26.5 23.6,26.5 23.4,26.7 v23.3,26.7 22.6,26.7 22.4,26.6 R51.1 | IC1.6 34.63,23.04 v35.2,23.6 | R51.1 22.4,26.7
  Bottom 0.254: v35.2,23.6 35.2,25 33.6,26.6 v23.3,26.7
D4*  (via drill 0.3)
  Top 0.254: 23.63,31.23 23.6,30.6 | 23.6,30.6 23.57,30.63 U1.2 U1.3 | U2.25 19.4,22.6 v18.5,23.5 | 23.6,30.6 23.5,30.6 23.4,30.5 23.4,29.8 v23.3,29.7
  Bottom 0.254: v18.5,23.5 18.5,29 19.5,30 23,30 v23.3,29.7
D5*  (via drill 0.3)
  Top 0.254: U5.11 42.55,14.05 42.85,13.7 42.85,12.1 42,11.3 37.8,11.3 v37.7,11.2 | U2.31 20.9,19.6 20,18.7 v20,18.5 | 11.15,19.65 U4.11 | 11.15,19.65 9.8,18.3 9.8,15.8 v9.95,15.7 | U3.11 14.45,27.45 14.8,27.8 v15.2,27.8 | 11.15,19.65 11.15,21.55 11.7,22.1 12.4,22.1 13.3,23 14.7,23 v15.4,23.7 | v17.8,15.7 19.6,15.7 v20,15.3
  Bottom 0.254: v20,18.5 v20,15.3 20.3,15 20.3,12.3 21.4,11.2 30.3,11.2 30.9,10.6 37.1,10.6 v37.7,11.2 | v17.8,15.7 v9.95,15.7 | v15.2,27.8 15.4,27.6 v15.4,23.7
D6*  (via drill 0.3)
  Top 0.254: U3.10 16.15,26.95 v16.3,26.8 | U5.10 42.25,13.55 42.4,13.4 42.4,12.5 41.8,11.9 37.1,11.9 v36.5,11.3 | U2.27 20.7,21.6 v20.4,21.3 | U4.10 12,20.27 12.4,20.68 v12.4,21.3 12.4,21.4 13.6,22.57 15.5,22.57 v16.3,23.7
  Bottom 0.254: v36.5,11.3 36.3,11.1 31.2,11.1 30.6,11.7 21.6,11.7 20.8,12.5 20.8,20.8 20.4,21.2 v20.4,21.3 20,20.9 16.4,20.9 16.1,21.2 14.5,21.2 14.4,21.1 12.6,21.1 v12.4,21.3 | v16.3,26.8 v16.3,23.7
D+  (via drill 0.3)
  Top 0.254: RP1.8 35,6.8 35.2,7 Z1.1 v35.2,7.9 | 27,7.1 J3.P3 27,8 v27.5,8.5
  Bottom 0.254: v35.2,7.9 34,9.1 30.1,9.1 29.7,9.5 28.5,9.5 v27.5,8.5
D-  (via drill 0.3)
  Top 0.254: RP1.7 35,6 35.4,5.6 Z2.1 v37,4.7 | J3.P2 26.34,8.44 v26.4,8.5
  Bottom 0.254: v26.4,8.5 27.9,10 29.9,10 30.3,9.6 35.5,9.6 36.9,8.2 36.9,4.8 v37,4.7
GND  (via drill 0.3)
  Top 0.254: R2.1 v10,34.8 | R8.1 v10,32.6 | R3.1 v10,30.4 10,29.9 9.7,29.65 7.8,29.65 7.6,29.8 7.6,30.3 7,30.9 5.5,30.9 5.2,30.6 5.2,28.4 5.3,28.3 | U3.7 U3.6 | 27.54,31.36 C12.2 v27.9,30.6 28.3,30.2 28.3,29.7 29,29 29,28.2 28.66,27.86 C1.1 | U6.1 39.65,27.14 40.09,26.69 40.09,24.6 | RP1.5 RP1.4 RP1.3 32,5.2 31.8,5.4 J3.S8 | RP1.6 RP1.5 | Z1.2 Z2.2 38.1,4.3 37.8,4 34.88,4 RP1.5 | U5.6 U5.7 39.73,13.38 | 39.73,13.38 40,13.1 40.62,13.1 U5.8 | R41.1 44.5,18.4 44.2,18.1 44.2,15.3 | R48.1 44.2,15.3 | C2.1 23.98,29.12 Y1.2 24.93,29.12 v25.6,29.9 | C3.2 C4.2 27.14,17.16 27,17.3 U2.43 27,20.3 26.7,20.6 | 43.3,30.7 43.3,28.8 43.2,28.8 42.9,28.5 42.9,28.3 | 43.3,30.7 43.3,32.4 43.6,32.7 | 42.9,28.3 42.9,25.8 | 42.9,25.8 42.15,25.05 ON.C 40.95,24.6 40.09,24.6 | R46.1 43,25.7 42.9,25.8 | R40.1 44.85,23.46 43.9,22.5 43.9,21 44.2,20.7 | 44.2,20.7 44.85,20.7 | v44,20.2 44,20.5 44.2,20.7 | v40.9,20.2 40.9,23.5 40.09,24.3 40.09,24.6 | 13.8,10.9 13.85,10.85 RESET.3 | 39.73,13.38 39.67,13.38 39.6,13.3 35.01,13.3 J2.6 34.47,10.43 35.5,9.4 37.7,9.4 38.1,9 Z1.2 | U4.6 U4.7 | 26.7,20.6 U2.5 29.4,20.6 29.7,20.3 30.04,20.3 C5.2 C13.2 | 26.7,20.6 25.5,20.6 U2.EXP | U2.EXP 26,22.1 U2.15 26,25.8 27.1,27 27.1,27.1 26.95,27.25 Y1.4 27.33,27.66 28.1,27.66 C1.1 | 24.5,21.6 22.5,23.6 U2.23 21.3,23.6 20.76,24.14 C7.2 20.4,24.4 19.5,25.3 18.65,25.3 TX.C 17.88,24.62 | 24.5,21.6 U2.EXP | U2.35 23,20.2 23.8,21 23.9,21 24.5,21.6 | R49.1 44.4,10.1 44.1,9.9 v44,9.6 | 5.1,25.7 5.1,28.1 5.3,28.3 | 5.1,25.7 5.1,23 | 5.1,23 5.1,17.8 | 5.1,17.8 5.1,12.5 | 5.1,12.5 5.1,7.3 | 5.1,7.3 5.1,6.5 5.6,6 | 5.1,25.7 5.2,25.5 6.8,25.5 7.8,24.5 9,24.5 | 5.1,23 6.8,23 7.8,21.95 8.9,21.95 9.14,21.76 R5.1
  Top 0.254: R6.1 9.14,16.96 9.1,17 | 9.1,17 7.8,17 7,17.8 5.1,17.8 | R11.1 9.14,17.04 9.1,17 | R12.1 9.14,12.04 9.1,11.95 | 9.1,11.95 7.6,11.95 7.1,12.5 5.1,12.5 | R7.1 9.14,11.96 9.1,11.95 | 44.8,6.5 39.9,6.5 39.4,7 Z1.2 | 44.8,6.5 49.3,6.5 50.2,7.4 51.4,7.4 51.7,7.7 51.7,7.74 JP12.2 | 44.8,6.5 44.85,6.55 R43.1 v44,7.6 | Z1.2 38.2,6.9 | JP6.1 1.36,7.94 1.9,7.4 5,7.4 5.1,7.3 | 15.8,20.5 15.8,22 17.7,23.9 17.7,24.45 17.88,24.62 | v17.8,14.5 20.5,14.5 20.8,14.8 20.8,15.96 R56.2 | U4.8 14.05,20.57 U4.7 | L.C 17.3,19.5 16.3,20.5 15.8,20.5 | 15.8,20.5 14.82,20.5 U4.7 | R10.1 9.14,24.36 9,24.5 | R4.1 9.14,24.64 9,24.5 | 5.3,28.3 6.6,28.3 7.8,27.05 9,27.05 9.14,27.14 R9.1 | U3.8 15.38,25.05 U3.7 | U3.7 17.88,24.62 | C1.1 C6.2 | R42.1 44.7,12.6 v44,11.9 | 42.9,28.3 44.76,28.3 R39.1 | R45.1 44.85,30.45 44.6,30.7 43.3,30.7 | 44.2,15.3 44.2,14.4 v44.1,14.3
  Top 0.406: J3.S6 J3.S5 J3.S7 23.7,6.7 24.11,7.11 24.41,7.11 J3.S10 23.51,8.14 C11.2 R59.1 20.54,8.14 20.2,7.8 20.2,7.4 19.7,6.9 17.2,6.9 16.3,6 15.9,6 14.9,5 14.9,4.7 C9.- 13.3,4.3 | J3.S8 J3.S6 | J3.S6 28.32,5.71 J3.P5 J3.S9 | RESET.4 22.25,10.85 21.9,11.2 v17.8,11.2 14.4,11.2 14.05,10.85 RESET.3 12.2,9.15 12.2,5.4 13.3,4.3 | 19.3,37.1 19.3,32.8 CP1.- | 19.3,37.1 19.3,37.74 C14.2 | U1.5 26.11,36.1 26,36 | 27.54,31.36 27.49,31.3 27.2,31.3 27,31.5 27,33.2 26,34.3 26,36 | U7.2 30,31.3 29.8,31.5 28.5,31.5 28.36,31.36 C12.2 | 30.09,27.24 RX.C 30.15,27.3 29,27.3 28.64,26.95 C6.2 | C10.- 42.1,34.2 43.6,32.7 43.7,32.6 R38.1 | R44.1 42.26,34.8 42.8,35.5 | C8.2 36.06,38.15 36.9,37.3 37.06,37.3 R58.1 37.15,37.3 38.1,37.3 38.8,38 42.97,38 | CN2.5 36,42.1 42.2,42.1 42.97,41.33 CN4.2 | 26,36 25.8,35.8 21.6,35.8 20.3,37.1 19.3,37.1 | R13.1 9.14,6.14 | 9.14,6.14 8.9,5.9 5.7,5.9 5.6,6 | 13.3,4.3 10.99,4.3 9.14,6.14 | C13.2 31.54,21.04 31.5,20.7
  Top 0.61: 31.5,20.7 31.5,20.95 32.22,21.77 IC1.7 | v40.9,20.2 40.9,20.5 IC1.1 IC1.2 | IC1.4 40.09,24.3
  Top 0.813: CP1.- 16,30 13,33 13,40.03 CN3.2 | C10.- 42.8,35.5 42.97,35.67 42.97,38 CN4.2
  Bottom 0.254: v10,30.4 v10,32.6 v10,34.8 10,36.1 13.07,39.17 CN3.2 | v44,20.2 v40.9,20.2 | v44,7.6 v44,9.6 v44,11.9 44,14.2 v44.1,14.3 | v27.9,30.6 27.9,30.1 27.4,29.6 25.9,29.6 v25.6,29.9 | v17.8,14.5 v17.8,11.2
  Bottom 0.406: 23.2,42.2 34.5,42.2 CN2.5 | 23.2,42.2 15.1,42.2 13.07,40.27 CN3.2 | CN1.5 23.2,42.2 | J3.S9 29.5,8.4 29.49,8.4 J3.S9 | J3.S10 24.5,8.9 24.51,8.9 J3.S10
  Bottom 1.27: JP7.2 JP7.1 JP8.1 JP8.2 JP9.1 JP9.2 JP10.1 JP10.2 JP11.1 JP11.2 JP12.1 JP12.2 | JP1.2 JP1.1 JP2.2 JP2.1 JP3.2 JP3.1 JP4.2 JP4.1 JP5.2 JP5.1 JP6.2 JP6.1
  pour Top (isolate 0.254): -0.1,43.2 54.1,43.2 54.1,2.8 -0.1,2.8
  pour Bottom (isolate 0.254): -0.2,43.2 54.2,43.2 54.2,2.8 -0.2,2.8
HWB
  Top 0.254: U2.33 21.4,18.6 21.3,18.5 21.3,17.1 21.24,16.94 R56.1
IO9*  (via drill 0.3)
  Top 0.254: v27.7,14.1 27.7,12.4 26.4,11.1 24.6,11.1 23.1,9.6 21.2,9.6 20.4,10.4 v20.2,10.4 | U5.3 37.05,15.55 v37,15.5 | U2.29 20,20.6 v19.2,19.8
  Bottom 0.254: v20.2,10.4 20.2,11 19.8,11.4 19.8,14.4 19.2,15 v19.2,19.8 | v37,15.5 36.6,15.5 35.1,14 31.2,14 30.7,14.5 28.1,14.5 v27.7,14.1
IO10*
  Top 0.254: U2.30 20.5,20.1 18.55,18.15 U4.3
IO11*  (via drill 0.3)
  Top 0.254: v17,22.1 v18.4,22.1 | U2.12 28.07,24.38 v28.1,24.4 | U3.3 12.95,24.25 v12.4,23.7
  Bottom 0.254: v28.1,24.4 28.1,23.9 27.3,23.1 19.4,23.1 v18.4,22.1 | v12.4,23.7 13.2,22.9 16.2,22.9 v17,22.1
IO12*  (via drill 0.3)
  Top 0.254: U5.9 41.15,12.65 40.9,12.4 v36.5,12.4 | U3.9 17.25,26.05 v17.3,26 | U2.26 19.9,22.1 v19.7,21.9 | U4.9 13.05,21.05 v13.9,21.9
  Bottom 0.254: 17.7,21.4 19.2,21.4 v19.7,21.9 19.9,22.1 20.8,22.1 21.3,21.6 21.3,12.7 21.8,12.2 30.8,12.2 31.4,11.6 35.7,11.6 v36.5,12.4 | v17.3,26 17.7,25.6 17.7,21.4 | v13.9,21.9 16.1,21.9 16.6,21.4 17.7,21.4
IO13*
  Top 0.254: U2.32 21.2,19.1 20.7,18.6 20.7,18 20.4,17.8 19.3,17.8 R52.1
MISO  (via drill 0.3)
  Top 0.254: U2.11 28.5,23.6 28.9,24.1 28.9,24.9 v29.25,25.2
  Bottom 0.254: v29.25,25.2 30.1,25.2 31.2,24.1 31.2,22.9 30.1,21.8 30.1,19.7 31.93,17.87 J2.1
MOSI  (via drill 0.3)
  Top 0.254: U2.10 28.8,23.1 v29.8,24.2
  Bottom 0.254: J2.4 34.47,15.33 33.2,16.6 31.1,16.6 30.1,17.6 30.1,18.4 29.6,18.9 29.6,22 30.6,23 30.6,23.6 30.1,24.1 v29.8,24.2
N$1
  Top 0.254: 6.52,34.7 JP1.5 7.92,33.7 R20.1 R8.2
N$2
  Top 0.406: R53.2 30.49,25.45 RX.A
N$3
  Top 0.254: R55.2 ON.A
N$4
  Top 0.254: R54.2 18.7,27.54 TX.A
N$5
  Top 0.254: R2.2 R14.1 JP1.6
N$6
  Top 0.254: R22.1 R10.2 6.91,23.8 JP3.5
N$7
  Top 0.254: R52.2 19.26,17 17.45,17 L.A
N$8
  Top 0.254: R9.2 R21.1 7.24,28.9 JP2.5
N$9
  Top 0.254: R3.2 8.26,31.45 8.2,31.5 | R15.1 8.2,31.5 | 8.2,31.5 7.18,31.5 JP2.6
N$10
  Top 0.254: R4.2 R16.1 6.95,26.3 JP3.6
N$11
  Top 0.254: JP4.5 6.53,19.1 R23.1 R11.2
N$12
  Top 0.254: R17.1 R5.2 6.87,21.3 JP4.6
N$13
  Top 0.254: JP5.5 6.68,13.8 R24.1 R12.2
N$14
  Top 0.254: JP5.6 8.15,16.3 R6.2 R18.1
N$15
  Top 0.254: JP6.5 7.22,7.9 R25.1 R13.2
N$16
  Top 0.254: JP6.6 6.48,11.22 6.5,11.2 R7.2 R19.1
N$17
  Top 0.254: R44.2 R32.2 46.14,35.9 JP7.5
N$18
  Top 0.254: R38.2 R26.2 46.48,33.7 JP7.6
N$19
  Top 0.254: JP9.5 R34.2 R46.2
N$20
  Top 0.254: R45.2 R33.2 46.82,31.5 JP8.5
N$21
  Top 0.254: R39.2 R27.2 47.16,29.3 JP8.6
N$22
  Top 0.254: R40.2 R28.2 45.84,24.5 47.33,24.5 JP9.6
N$23
  Top 0.254: JP10.5 47.49,21.8 45.74,21.8 45.74,20.7
N$24
  Top 0.254: JP10.6 47.25,19.5 R29.2 R41.2
N$25
  Top 0.254: JP11.5 47.46,16.4 R36.2 R48.2
N$26
  Top 0.254: JP11.6 47.5,13.7 R30.2 R42.2
N$27
  Top 0.254: JP12.5 47.54,11.2 R37.2 R49.2
N$28
  Top 0.254: JP12.6 47.54,8.7 R31.2 R43.2
N$67
  Top 0.254: J1.1 28.53,39.91 R1.1
RD+
  Top 0.254: U2.4 29.2,20.1 30.1,19.2 30.1,14.6 29.4,13.9 29.4,12.4 30.1,11.7 33.12,8.47 RP1.1
RD-
  Top 0.254: U2.3 29,19.6 29.6,19 29.6,15 28.9,14.3 28.9,12 29.6,11.3 32.1,8.7 32.1,6.4 32.5,6 RP1.2
RESET  (via drill 0.3)
  Top 0.254: U2.13 27,24.9 27.5,25.3 v27.8,25.3 | R50.2 23.66,16.06 v23.8,16.2 | v20.5,29.3 v20.5,35.5 | CN1.3 21.4,40 24,40 24.5,40.5 v25.2,40.5 25.1,40.4
  Top 0.406: D1.A RESET.2 22.35,15.3 R50.2 | 22.3,13.3 D1.A | D1.A v23.6,13.4
  Bottom 0.254: v23.8,16.2 23.8,22 24.4,22.5 27.5,22.5 28.8,23.8 28.8,24.7 28.2,25.3 v27.8,25.3 24.4,25.3 23.2,24.1 21,24.1 20.5,24.6 v20.5,29.3 | v20.5,35.5 20.5,41.2 CN1.3 | J2.5 24.24,12.76 v23.6,13.4 | CN2.3 32.4,40.4 31.9,39.9 25.6,39.9 25.2,40.3 v25.2,40.5
RS485_A
  Top 0.254: CN1.1 18.2,42.31 25.1,42.31 26.05,41.54 R1.2 | U1.6 24.84,38.23 26,39.4 26,41.44 R1.2 | CN2.1 28.6,42.3 26.5,42.3 26.05,41.85 R1.2
RS485_B  (via drill 0.3)
  Top 0.254: CN1.2 20.9,39.3 22.7,39.3 23.57,38.44 | 23.57,38.44 U1.7 | 23.57,38.44 23.57,38.47 v24.4,39.3
  Top 0.406: CN2.2 31.07,41.43 J1.2
  Bottom 0.254: J1.2 28.37,39.3 v24.4,39.3
RXLED/SS
  Top 0.254: U2.8 29.7,22.1 31.16,23.55 R53.1
SCK  (via drill 0.3)
  Top 0.254: U2.9 29.1,22.6 29.7,23.2 v29.9,23.3
  Bottom 0.254: J2.3 30.6,15.3 29.6,16.3 29.6,18.1 29.1,18.6 29.1,22.6 29.7,23.2 v29.9,23.3
SRV0
  Top 0.254: U3.13 13.45,28.05 11.7,29.8 11.7,34 10,35.9 R14.2
SRV1
  Top 0.254: U3.14 12.95,27.85 11.2,29.6 11.2,32.2 10.1,33.7 R20.2
SRV2
  Top 0.254: U3.15 12.45,27.55 10.7,29.4 10.7,30.9 10.1,31.5 R15.2
SRV3  (via drill 0.3)
  Top 0.254: U3.12 13.95,28.05 v14.3,28.4 | v10.8,26.7 10.8,27.9 9.8,28.9 R21.2
  Bottom 0.254: v14.3,28.4 12.7,26.7 v10.8,26.7
SRV4
  Top 0.254: U3.1 10.55,25.55 9.8,26.3 R16.2
SRV5  (via drill 0.3)
  Top 0.254: U3.5 13.95,23.95 v14.2,23.7 | v10.3,24.8 10.1,24.5 10.1,23.1 9.7,22.7 R22.2
  Bottom 0.254: v14.2,23.7 14.2,24.3 13.7,24.8 v10.3,24.8
SRV6
  Top 0.254: U3.2 12.43,24.6 11.5,24.6 10.8,23.9 10.8,22.8 9.9,21.9 9.9,20.8 9.3,20.2 R17.2
SRV7
  Top 0.254: U3.4 13.45,23.75 12.3,22.6 11.4,22.6 10.4,21.6 10.4,20 9.5,19.1 R23.2 | 9.2,19.1 R23.2 | R23.2
SRV8
  Top 0.254: 12.25,18.65 U4.13 11.55,18.65 10.9,18 10.9,17.2 11.3,16.8 11.3,15.6 10.7,15 9.2,15 R18.2
SRV9
  Top 0.254: R24.2 11.2,13.8 11.8,14.4 11.8,17 11.4,17.4 11.4,17.8 11.75,18.15 U4.14
SRV10
  Top 0.254: R19.2 11.1,10.1 12.3,11.3 12.3,17.48 U4.15
SRV11  (via drill 0.3)
  Top 0.254: v8.3,9 8.9,9 9.14,8.75 R25.2 | U4.12 11.35,19.15 10.4,18.2 10.4,16.5 v10.5,16.4
  Bottom 0.254: v10.5,16.4 8.3,16.4 7.7,15.7 7.7,9.6 v8.3,9
SRV12  (via drill 0.3)
  Top 0.254: v15.3,16.9 15.15,17.05 13.72,17.05 U4.1 | R32.1 v44,35.9
  Bottom 0.254: v15.3,16.9 15.1,17.1 9.1,17.1 7.7,18.5 7.7,27.8 9.3,29.4 9.6,29.4 10.3,29.4 10.8,29.9 14.5,33.6 38.4,33.6 38.8,34 38.8,35.7 39,35.9 v44,35.9
SRV13  (via drill 0.3)
  Top 0.254: U4.5 15.25,19.15 15.4,19.3 v15.4,19.8 | R26.1 44.66,34 v43.7,34
  Bottom 0.254: v43.7,34 41.8,32.1 15.3,32.1 10.6,27.4 10,27.4 9.5,26.9 9.5,22 10.9,20.6 14.6,20.6 v15.4,19.8
SRV14  (via drill 0.3)
  Top 0.254: U4.2 15.75,17.65 v16,17.4 | v44,31.4 44.76,31.4 R33.1
  Bottom 0.254: v16,17.4 15.8,17.6 9.3,17.6 8.2,18.7 8.2,27.5 9.2,28.5 10.2,28.5 14.8,33.1 40.8,33.1 42.9,35.2 44.5,35.2 45,34.7 45,32.4 v44,31.4
SRV15  (via drill 0.3)
  Top 0.254: U4.4 15.85,18.65 v16.1,18.9 | R27.1 44.16,29.6 v44,29.7
  Bottom 0.254: v44,29.7 43.4,29.9 43,30.3 43,32.1 44.5,33.6 44.5,34.4 44.2,34.7 43.2,34.7 41.1,32.6 15.1,32.6 10.4,27.9 9.4,27.9 9,27.5 9,21.8 10.7,20.1 13.8,20.1 15,18.9 v16.1,18.9
SRV16  (via drill 0.3)
  Top 0.254: U5.13 42.85,15.05 43.3,15.5 43.3,23 v43.8,23.6 | R34.1 44.2,26.8 v43.8,26.4
  Bottom 0.254: v43.8,23.6 v43.8,26.4
SRV17
  Top 0.254: U5.14 42.55,15.55 42.8,15.8 42.8,23.8 43.6,24.6 R28.1
SRV18  (via drill 0.3)
  Top 0.254: 44.85,21.8 44.85,22.36 v45.3,22.6 | v41.9,22 41.9,16.07 U5.15
  Bottom 0.254: v45.3,22.6 42.5,22.6 v41.9,22
SRV19
  Top 0.254: U5.12 43.25,14.55 43.75,15 43.75,19 44.2,19.5 R29.1
SRV20  (via drill 0.3)
  Top 0.254: R36.1 44.85,17.06 v44.9,17.3 | U5.1 40.65,17.15 v40.4,17.3
  Bottom 0.254: v44.9,17.3 v40.4,17.3
SRV21  (via drill 0.3)
  Top 0.254: U5.5 39.25,14.55 v38.8,14 | v38.8,10.6 42.4,10.6 43.3,11.5 43.3,13.2 43.5,13.4 44.55,13.4 R30.1
  Bottom 0.254: v38.8,10.6 v38.8,14
SRV22  (via drill 0.3)
  Top 0.254: R37.1 44,11.2 42.8,9.8 v40.2,9.8 | U5.2 39.6,16.07 39.52,16.07 39.4,16.2 v39.4,16.7
  Bottom 0.254: v40.2,9.8 40.2,16.2 v39.4,16.7
SRV23  (via drill 0.3)
  Top 0.254: v39.4,8.8 44.7,8.8 44.8,8.7 R31.1 | U5.4 38.65,15.05 v38.4,14.8
  Bottom 0.254: v39.4,8.8 39.4,9.9 39.6,10.2 39.6,14.3 39.1,14.8 v38.4,14.8
TXLED
  Top 0.254: U2.22 22.5,24.3 22.48,24.27 22.48,24.23 22.5,24.2 22.48,24.18 21.43,24.18 20.8,24.9 20.5,25.3 20.5,26.26 R54.1
UCAP
  Top 0.254: U2.6 29.6,21.1 29.74,21.14 C5.1
VIN  (via drill 0.3)
  Top 0.406: v33.8,35.2 34.76,35.2 T2.1 | T1.3 37.1,33.29 v37.1,35.3 | 37.1,38.3 R58.2 37.1,38.4
  Top 0.813: CN4.1 39.63,39.3 37.1,39.3 | 37.1,39.3 35.2,39.3 34.77,38.88 T2.1 | 37.1,39.3 37.1,38.4
  Bottom 0.406: v33.8,35.2 33.9,35.3 v37.1,35.3
VUSB  (via drill 0.3)
  Top 0.254: v31.4,22.1 30.4,22.1 29.9,21.6 U2.7
  Top 0.406: C11.1 R59.2 21.16,7.25 v20.6,6.7 18.6,4.7 18.05,4.7 F1.2 17.85,4.5 | v38.1,36.5 38.1,35.34 T1.1
  Bottom 0.406: v20.6,6.7 21.1,7.2 21.1,9 22.7,10.6 30.1,10.6 30.6,10.1 35.8,10.1 39.7,6.2 47.6,6.2 48.8,7.4 48.8,28.6 | 48.8,28.6 48.8,38.2 48.3,38.7 46.8,38.7 44.9,36.7 38.3,36.7 v38.1,36.5 | v31.4,22.1 36.1,22.1 42.4,28.3 48.5,28.3 48.8,28.6
VUSBD
  Top 0.406: J3.P1 25.68,8.22 24.9,9 18.45,9 F1.1 15.55,8.35 C9.+
XTAL1
  Top 0.254: C2.2 23.4,27.6 23.9,27.3 24.62,27.3 Y1.3 25,26.93 U2.17
XTAL2
  Top 0.254: U2.16 25.5,26.2 25.8,26.6 25.8,28.3 26.3,28.7 27.02,28.73 Y1.1 27.92,29.12 C1.2

### Text on the board
Top: THIS PCB LAYOUT IS PROVIDED BY THE COPYRIGHT HOLDERS AND CONTRIBUTORS "AS IS" / AND ANY EXPRESS OR IMPLIED WARRANTIES, INCLUDING, BUT NOT LIMITED TO, THE / IMPLIED WARRANTIES OF MERCHANTABILITY AND FITNESS FOR A PARTICULAR PURPOSE / ARE DISCLAIMED. IN NO EVENT SHALL <COPYRIGHT HOLDER> BE LIABLE FOR ANY / DIRECT, INDIRECT, INCIDENTAL, SPECIAL, EXEMPLARY, OR CONSEQUENTIAL DAMAGES / (INCLUDING, BUT NOT LIMITED TO, PROCUREMENT OF SUBSTITUTE GOODS OR SERVICES; / LOSS OF USE, DATA, OR PROFITS; OR BUSINESS INTERRUPTION) HOWEVER CAUSED AND / ON ANY THEORY OF LIABILITY, WHETHER IN CONTRACT, STRICT LIABILITY, OR TORT / (INCLUDING NEGLIGENCE OR OTHERWISE) ARISING IN ANY WAY OUT OF THE USE OF THIS / PCB LAYOUT, EVEN IF ADVISED OF THE POSSIBILITY OF SUCH DAMAGE.
layer 125: JP1 | R1 | JP7 | JP2 | CN3 | CN4 | JP8 | JP3 | R58 | JP9 | CN1 | CN2 | C14 | C8 | R14 | CP1 | R32 | R2 | T2 | T1 | C10 | R44 | U1 | J1 | U7 | R26 | R20 | R38 | R8 | R33 | R15 | C12 | R45 | R3 | R21 | R27 | R39 | R9 | U3 | R54 | R57 | R51 | C1 | R55 | R34 | R16 | C2 | Y1 | RX | U6 | R46 | R4 | TX | U2 | C6 | IC1 | R28 | R10 | C7 | R53 | ON | R40 | R22 | R35 | R5 | U4 | R47 | R17 | L | R29 | R23 | C5 | C13 | R41 | R11 | R52 | R56 | C4 | J2 | R36 | R6 | R50 | C3 | R48 | R18 | L1 | R30 | R24 | R42 | R12 | D1 | U5 | R7 | R37 | R19 | R49 | RESET | R31 | R25 | R43 | JP4 | C9 | R59 | C11 | RP1 | Z1 | JP10 | JP5 | R13 | JP11 | JP6 | F1 | Z2 | JP12